# EAGLE design Display_Board_v2 (EAGLE 8.7.0)

## Sheet 1 of 3: Micro and CAN
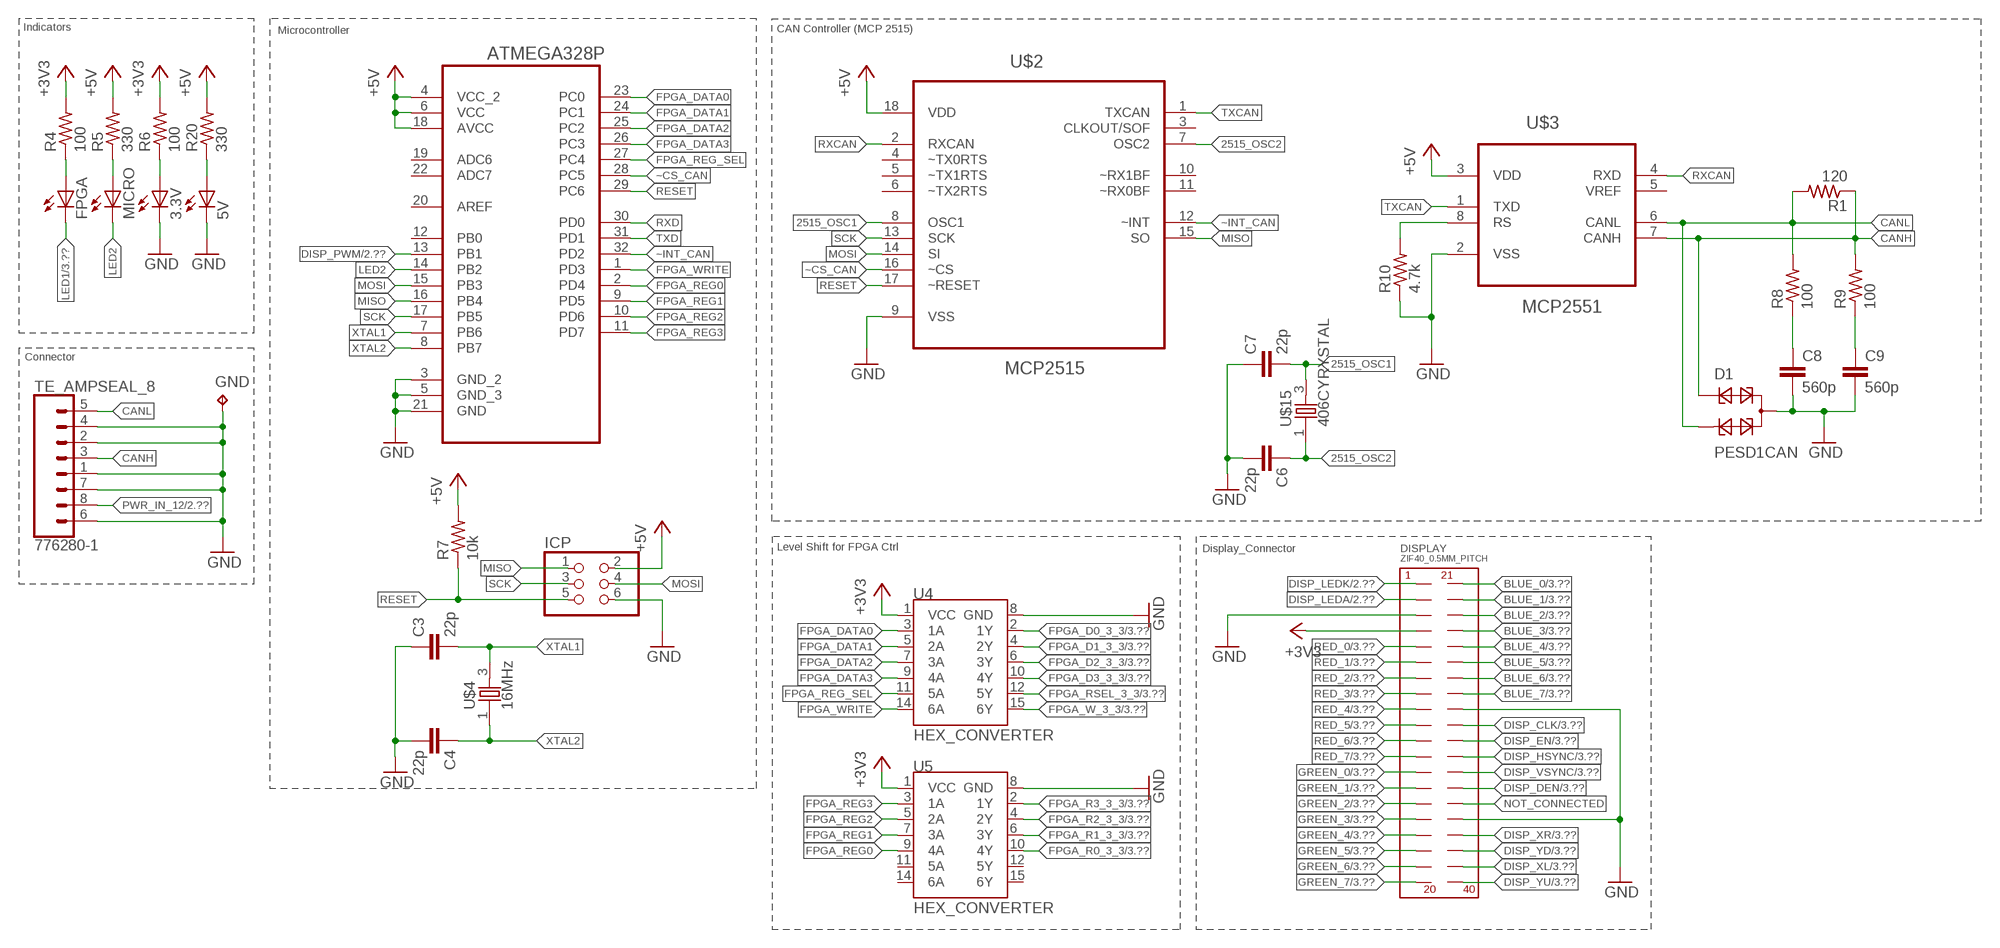
[diagram p0: schematic, sheet 1]

### Parts
3.3V  LEDCHIP-LED0805  [CHIP-LED0805]
5V  LEDCHIP-LED0805  [CHIP-LED0805]
ATMEGA328P  ATMEGA328P-AU  [QFP80P900X900X120-32N]
C3  22p  C-EUC0805K  [C0805K]
C4  22p  C-EUC0805K  [C0805K]
C6  22p  C-EUC0805K  [C0805K]
C7  22p  C-EUC0805K  [C0805K]
C8  560p  C-EUC0805K  [C0805K]
C9  560p  C-EUC0805K  [C0805K]
D1  PESD1CAN  [SOT23]
DISPLAY  ZIF40_0.5MM_PITCH  [ZIF40]
FPGA  LEDCHIP-LED0805  [CHIP-LED0805]
GND  TPTP12SQ  [TP12SQ]
ICP  PINHD-2X3  [2X03]
MICRO  LEDCHIP-LED0805  [CHIP-LED0805]
R1  120  R-US_R0805  [R0805]
R4  100  R-US_R0805  [R0805]
R5  330  R-US_R0805  [R0805]
R6  100  R-US_R0805  [R0805]
R7  10k  R-US_R0805  [R0805]
R8  100  R-US_R0805  [R0805]
R9  100  R-US_R0805  [R0805]
R10  4.7k  R-US_R0805  [R0805]
R20  330  R-US_R0805  [R0805]
TE_AMPSEAL_8  776280-1  [776280-1]
U4  HEX_CONVERTER  [SO016]
U5  HEX_CONVERTER  [SO016]
U$2  MCP2515  MCP2515-I/SO  [SOIC127P1034X264-18N]
U$3  MCP2551  MCP2551-I/SN  [SOIC127P600X175-8N]
U$4  16MHz  406CYRYSTAL  [CTS406]
U$15  406CYRYSTAL  [CTS406]

### Nets
2515_OSC1: C7.2 U$2.8(OSC1) U$15.3
2515_OSC2: C6.1 U$2.7(OSC2) U$15.1
+3V3: DISPLAY.P$4 R4.2 R6.2 U4.1(VCC) U5.1(VCC) ; also sheet 2,3
+5V: ATMEGA328P.4(VCC_2) ATMEGA328P.6(VCC) ATMEGA328P.18(AVCC) ICP.2 R5.2 R7.2 R20.2 U$2.18(VDD) U$3.3(VDD) ; also sheet 2
BLUE_0: DISPLAY.P$21 ; also sheet 3
BLUE_1: DISPLAY.P$22 ; also sheet 3
BLUE_2: DISPLAY.P$23 ; also sheet 3
BLUE_3: DISPLAY.P$24 ; also sheet 3
BLUE_4: DISPLAY.P$25 ; also sheet 3
BLUE_5: DISPLAY.P$26 ; also sheet 3
BLUE_6: DISPLAY.P$27 ; also sheet 3
BLUE_7: DISPLAY.P$28 ; also sheet 3
CANH: D1.1 R1.1 R9.2 TE_AMPSEAL_8.3 U$3.7(CANH)
CANL: D1.2 R1.2 R8.2 TE_AMPSEAL_8.5 U$3.6(CANL)
DISP_CLK: DISPLAY.P$30 ; also sheet 3
DISP_DEN: DISPLAY.P$34 ; also sheet 3
DISP_EN: DISPLAY.P$31 ; also sheet 3
DISP_HSYNC: DISPLAY.P$32 ; also sheet 3
DISP_LEDA: DISPLAY.P$2 ; also sheet 2
DISP_LEDK: DISPLAY.P$1 ; also sheet 2
DISP_PWM: ATMEGA328P.13(PB1) ; also sheet 2
DISP_VSYNC: DISPLAY.P$33 ; also sheet 3
DISP_XL: DISPLAY.P$39 ; also sheet 3
DISP_XR: DISPLAY.P$37 ; also sheet 3
DISP_YD: DISPLAY.P$38 ; also sheet 3
DISP_YU: DISPLAY.P$40 ; also sheet 3
FPGA_D0_3_3: U4.2(1Y) ; also sheet 3
FPGA_D1_3_3: U4.4(2Y) ; also sheet 3
FPGA_D2_3_3: U4.6(3Y) ; also sheet 3
FPGA_D3_3_3: U4.10(4Y) ; also sheet 3
FPGA_DATA0: ATMEGA328P.23(PC0) U4.3(1A)
FPGA_DATA1: ATMEGA328P.24(PC1) U4.5(2A)
FPGA_DATA2: ATMEGA328P.25(PC2) U4.7(3A)
FPGA_DATA3: ATMEGA328P.26(PC3) U4.9(4A)
FPGA_R0_3_3: U5.10(4Y) ; also sheet 3
FPGA_R1_3_3: U5.6(3Y) ; also sheet 3
FPGA_R2_3_3: U5.4(2Y) ; also sheet 3
FPGA_R3_3_3: U5.2(1Y) ; also sheet 3
FPGA_REG0: ATMEGA328P.2(PD4) U5.9(4A)
FPGA_REG1: ATMEGA328P.9(PD5) U5.7(3A)
FPGA_REG2: ATMEGA328P.10(PD6) U5.5(2A)
FPGA_REG3: ATMEGA328P.11(PD7) U5.3(1A)
FPGA_REG_SEL: ATMEGA328P.27(PC4) U4.11(5A)
FPGA_RSEL_3_3: U4.12(5Y) ; also sheet 3
FPGA_W_3_3: U4.15(6Y) ; also sheet 3
FPGA_WRITE: ATMEGA328P.1(PD3) U4.14(6A)
GND: 3.3V.C 5V.C ATMEGA328P.3(GND_2) ATMEGA328P.5(GND_3) ATMEGA328P.21(GND) C3.1 C4.2 C6.2 C7.1 C8.2 C9.2 D1.3 DISPLAY.P$3 DISPLAY.P$29 DISPLAY.P$36 GND.TP ICP.6 R10.1 TE_AMPSEAL_8.1 TE_AMPSEAL_8.2 TE_AMPSEAL_8.4 TE_AMPSEAL_8.6 TE_AMPSEAL_8.7 U4.8(GND) U5.8(GND) U$2.9(VSS) U$3.2(VSS) ; also sheet 2,3
GREEN_0: DISPLAY.P$13 ; also sheet 3
GREEN_1: DISPLAY.P$14 ; also sheet 3
GREEN_2: DISPLAY.P$15 ; also sheet 3
GREEN_3: DISPLAY.P$16 ; also sheet 3
GREEN_4: DISPLAY.P$17 ; also sheet 3
GREEN_5: DISPLAY.P$18 ; also sheet 3
GREEN_6: DISPLAY.P$19 ; also sheet 3
GREEN_7: DISPLAY.P$20 ; also sheet 3
LED1: FPGA.C ; also sheet 3
LED2: ATMEGA328P.14(PB2) MICRO.C
MISO: ATMEGA328P.16(PB4) ICP.1 U$2.15(SO)
MOSI: ATMEGA328P.15(PB3) ICP.4 U$2.14(SI)
N$2: FPGA.A R4.1
N$3: MICRO.A R5.1
N$4: 3.3V.A R6.1
N$5: R10.2 U$3.8(RS)
N$6: C8.1 R8.1
N$7: C9.1 R9.1
N$12: 5V.A R20.1
NOT_CONNECTED: DISPLAY.P$35
PWR_IN_12: TE_AMPSEAL_8.8 ; also sheet 2
RED_0: DISPLAY.P$5 ; also sheet 3
RED_1: DISPLAY.P$6 ; also sheet 3
RED_2: DISPLAY.P$7 ; also sheet 3
RED_3: DISPLAY.P$8 ; also sheet 3
RED_4: DISPLAY.P$9 ; also sheet 3
RED_5: DISPLAY.P$10 ; also sheet 3
RED_6: DISPLAY.P$11 ; also sheet 3
RED_7: DISPLAY.P$12 ; also sheet 3
RESET: ATMEGA328P.29(PC6) ICP.5 R7.1 U$2.17(~RESET)
RXCAN: U$2.2(RXCAN) U$3.4(RXD)
RXD: ATMEGA328P.30(PD0)
SCK: ATMEGA328P.17(PB5) ICP.3 U$2.13(SCK)
TXCAN: U$2.1(TXCAN) U$3.1(TXD)
TXD: ATMEGA328P.31(PD1)
XTAL1: ATMEGA328P.7(PB6) C3.2 U$4.3
XTAL2: ATMEGA328P.8(PB7) C4.1 U$4.1
~CS_CAN: ATMEGA328P.28(PC5) U$2.16(~CS)
~INT_CAN: ATMEGA328P.32(PD2) U$2.12(~INT)
Unconnected: ATMEGA328P.12(PB0) ATMEGA328P.19(ADC6) ATMEGA328P.20(AREF) ATMEGA328P.22(ADC7) U5.11(5A) U5.12(5Y) U5.14(6A) U5.15(6Y) U$2.3(CLKOUT/SOF) U$2.4(~TX0RTS) U$2.5(~TX1RTS) U$2.6(~TX2RTS) U$2.10(~RX1BF) U$2.11(~RX0BF) U$3.5(VREF)

### Notes on the sheet
- Indicators | Microcontroller | CAN Controller (MCP 2515)
- Connector
- Level Shift for FPGA Ctrl | Display_Connector

## Sheet 2 of 3: Power
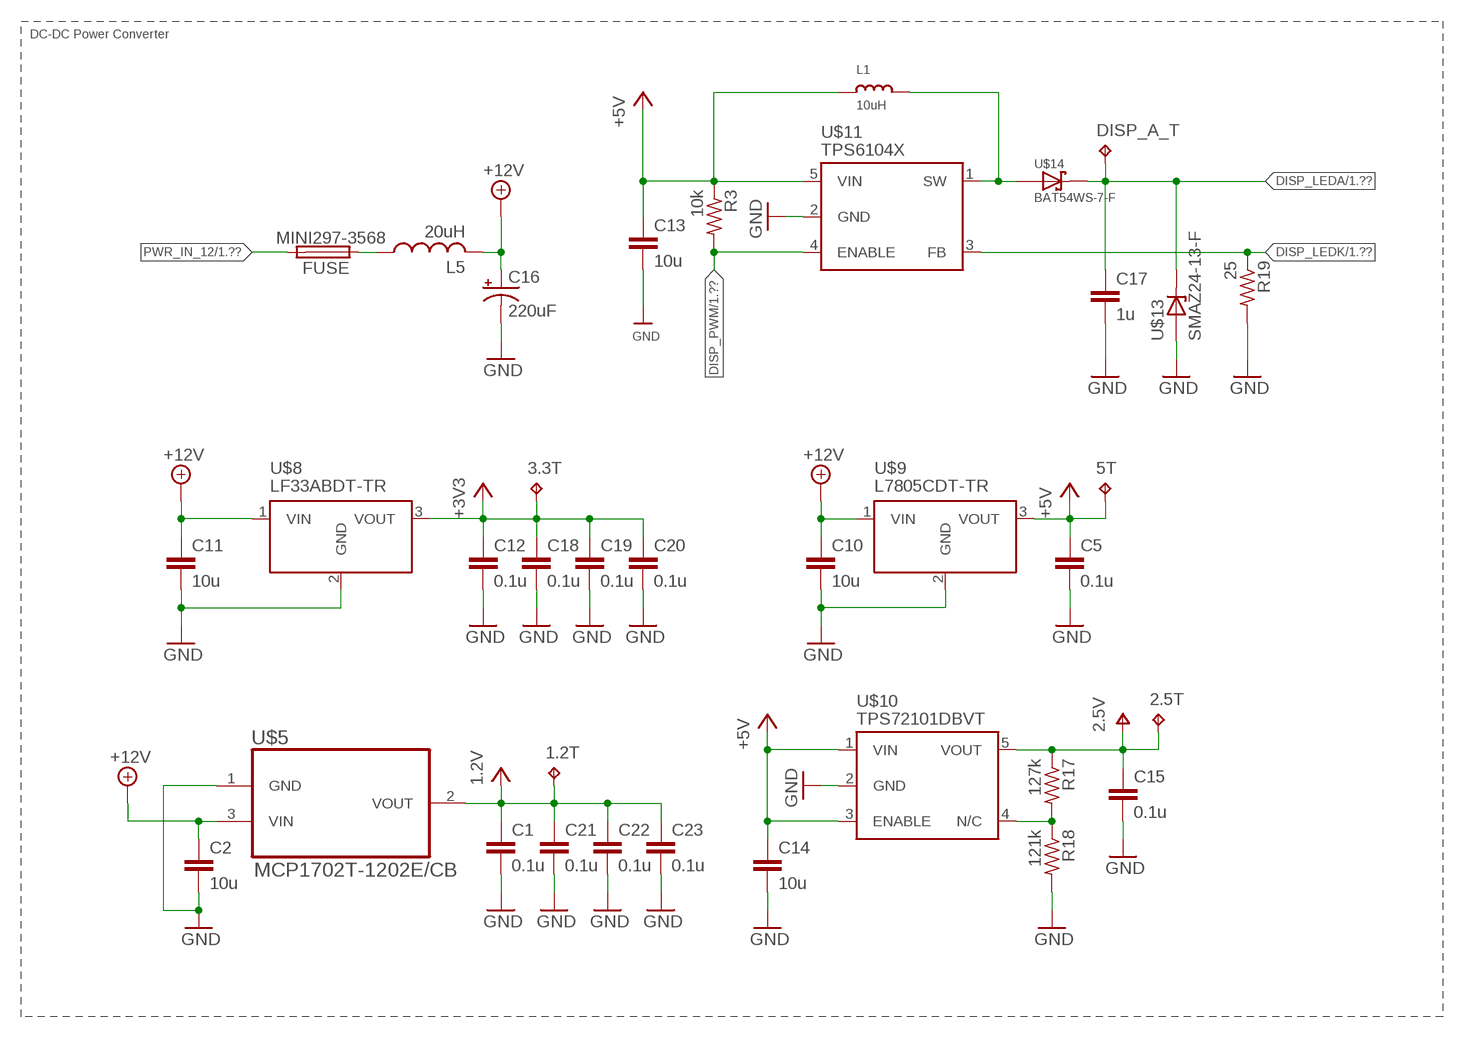
[diagram p1: schematic, sheet 2]

### Parts
1.2T  TPTP12SQ  [TP12SQ]
2.5T  TPTP12SQ  [TP12SQ]
3.3T  TPTP12SQ  [TP12SQ]
5T  TPTP12SQ  [TP12SQ]
C1  0.1u  C-EUC0805K  [C0805K]
C2  10u  C-EUC0805K  [C0805K]
C5  0.1u  C-EUC0805K  [C0805K]
C10  10u  C-EUC0805K  [C0805K]
C11  10u  C-EUC0805K  [C0805K]
C12  0.1u  C-EUC0805K  [C0805K]
C13  10u  C-EUC0805K  [C0805K]
C14  10u  C-EUC0805K  [C0805K]
C15  0.1u  C-EUC0805K  [C0805K]
C16  220uF  CPOL-USUD-6,3X7,7  [UD-6,3X7,7_NICHICON]
C17  1u  C-EUC0805K  [C0805K]
C18  0.1u  C-EUC0805K  [C0805K]
C19  0.1u  C-EUC0805K  [C0805K]
C20  0.1u  C-EUC0805K  [C0805K]
C21  0.1u  C-EUC0805K  [C0805K]
C22  0.1u  C-EUC0805K  [C0805K]
C23  0.1u  C-EUC0805K  [C0805K]
DISP_A_T  TPTP12SQ  [TP12SQ]
FUSE  MINI297-3568  [3568]
L1  10uH  INDUCTORNR5040  [INDUCTOR_5X5MM_NR5040_NOTHERMALS]
L5  20uH  MSS7348  [MSS7348]
R3  10k  R-US_R0805  [R0805]
R17  127k  R-US_R0805  [R0805]
R18  121k  R-US_R0805  [R0805]
R19  25  R-US_R0805  [R0805]
U$5  MCP1702T-1202E/CB  MCP1702T-1802E/CB  [SOT95P300X145-3N]
U$8  LF33ABDT-TR  [DPACK]
U$9  L7805CDT-TR  [DPACK]
U$10  TPS72101DBVT  [SOT23-5L]
U$11  TPS6104X  [SOT23-5L]
U$13  SMAZ24-13-F  [SMA_DIODE]
U$14  BAT54WS-7-F  [SOD323]

### Nets
+3V3: 3.3T.TP C12.1 C18.1 C19.1 C20.1 U$8.3(VOUT) ; also sheet 1,3
+5V: 5T.TP C5.1 C13.1 C14.1 L1.P$1 R3.1 U$9.3(VOUT) U$10.1(VIN) U$10.3(ENABLE) U$11.5(VIN) ; also sheet 1
+12V: C2.1 C10.1 C11.1 C16.+ L5.P$2 U$5.3(VIN) U$8.1(VIN) U$9.1(VIN)
DISP_LEDA: C17.1 DISP_A_T.TP U$13.C U$14.1(C) ; also sheet 1
DISP_LEDK: R19.1 U$11.3(FB) ; also sheet 1
DISP_PWM: R3.2 U$11.4(ENABLE) ; also sheet 1
GND: C1.2 C2.2 C5.2 C10.2 C11.2 C12.2 C13.2 C14.2 C15.2 C16.- C17.2 C18.2 C19.2 C20.2 C21.2 C22.2 C23.2 R18.2 R19.2 U$5.1(GND) U$8.2(GND) U$9.2(GND) U$10.2(GND) U$11.2(GND) U$13.A ; also sheet 1,3
N$1: FUSE.P$1 FUSE.P$4 L5.P$1
N$8: L1.P$2 U$11.1(SW) U$14.2(A)
N$19: R17.2 R18.1 U$10.4(N/C)
PWR_IN_12: FUSE.P$2 FUSE.P$3 ; also sheet 1
V+: 2.5T.TP C15.1 R17.1 U$10.5(VOUT) ; supply symbol labelled 2.5V ; also sheet 3
VCC: 1.2T.TP C1.1 C21.1 C22.1 C23.1 U$5.2(VOUT) ; supply symbol labelled 1.2V ; also sheet 3

### Notes on the sheet
- DC-DC Power Converter

## Sheet 3 of 3: Cyclone 10 FPGA
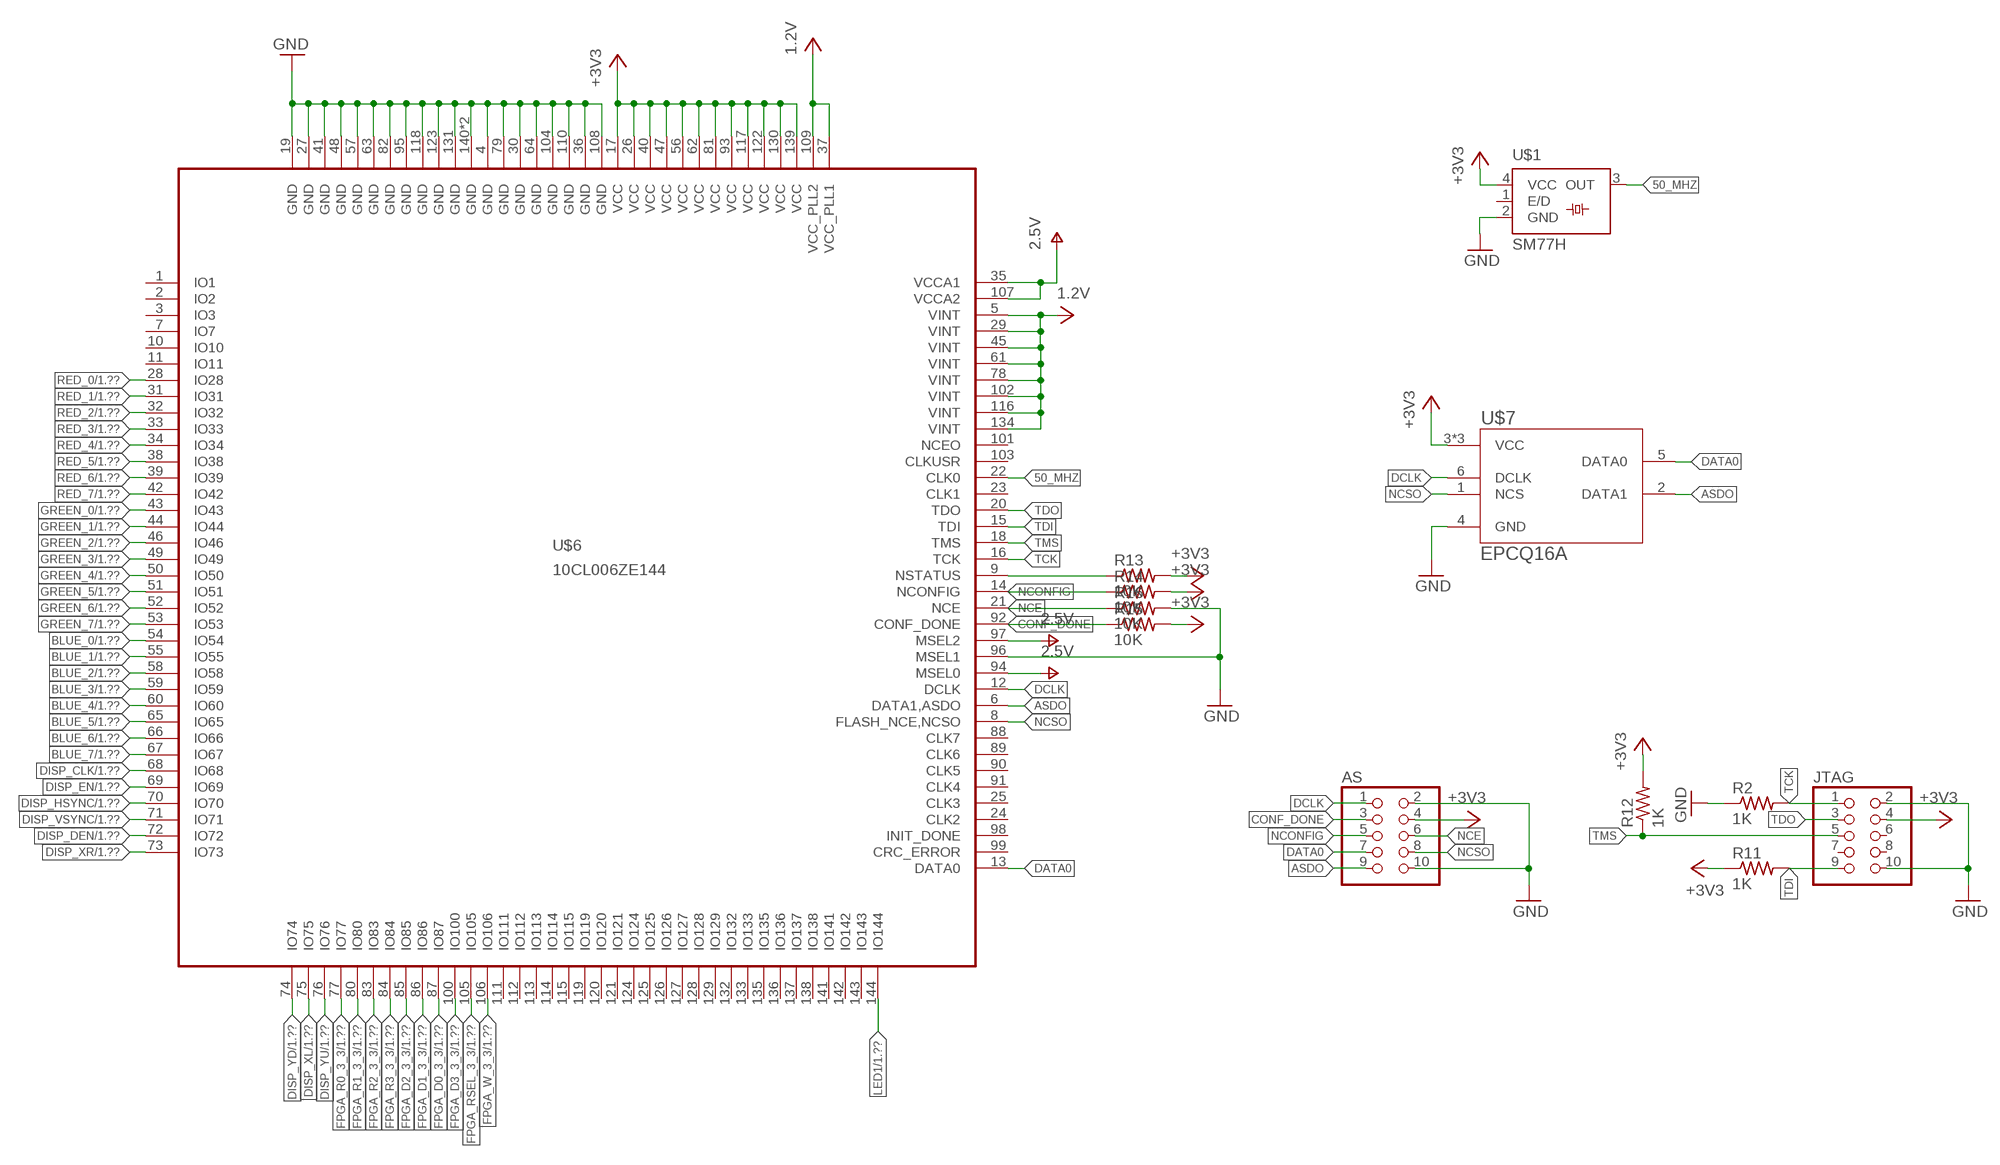
[diagram p2: schematic, sheet 3]

### Parts
AS  PINHD-2X5  [2X05]
JTAG  PINHD-2X5  [2X05]
R2  1K  R-US_R0805  [R0805]
R11  1K  R-US_R0805  [R0805]
R12  1K  R-US_R0805  [R0805]
R13  10K  R-US_R0805  [R0805]
R14  10K  R-US_R0805  [R0805]
R15  10K  R-US_R0805  [R0805]
R16  10K  R-US_R0805  [R0805]
U$1  SM77H  [SM77H]
U$6  10CL006ZE144  [EQFP144]
U$7  EPCQ16A  [SOIC127P600X175-8N]

### Nets
50_MHZ: U$1.3(OUT) U$6.22(CLK0)
+3V3: AS.4 JTAG.4 R11.1 R12.2 R13.2 R14.2 R15.2 U$1.4(VCC) U$6.17(VCC) U$6.26(VCC) U$6.40(VCC) U$6.47(VCC) U$6.56(VCC) U$6.62(VCC) U$6.81(VCC) U$6.93(VCC) U$6.117(VCC) U$6.122(VCC) U$6.130(VCC) U$6.139(VCC) U$7.3(VCC) U$7.7(VCC) U$7.8(VCC) ; also sheet 1,2
ASDO: AS.9 U$6.6(DATA1,ASDO) U$7.2(DATA1)
BLUE_0: U$6.54(IO54) ; also sheet 1
BLUE_1: U$6.55(IO55) ; also sheet 1
BLUE_2: U$6.58(IO58) ; also sheet 1
BLUE_3: U$6.59(IO59) ; also sheet 1
BLUE_4: U$6.60(IO60) ; also sheet 1
BLUE_5: U$6.65(IO65) ; also sheet 1
BLUE_6: U$6.66(IO66) ; also sheet 1
BLUE_7: U$6.67(IO67) ; also sheet 1
CONF_DONE: AS.3 R15.1 U$6.92(CONF_DONE)
DATA0: AS.7 U$6.13(DATA0) U$7.5(DATA0)
DCLK: AS.1 U$6.12(DCLK) U$7.6(DCLK)
DISP_CLK: U$6.68(IO68) ; also sheet 1
DISP_DEN: U$6.72(IO72) ; also sheet 1
DISP_EN: U$6.69(IO69) ; also sheet 1
DISP_HSYNC: U$6.70(IO70) ; also sheet 1
DISP_VSYNC: U$6.71(IO71) ; also sheet 1
DISP_XL: U$6.75(IO75) ; also sheet 1
DISP_XR: U$6.73(IO73) ; also sheet 1
DISP_YD: U$6.74(IO74) ; also sheet 1
DISP_YU: U$6.76(IO76) ; also sheet 1
FPGA_D0_3_3: U$6.87(IO87) ; also sheet 1
FPGA_D1_3_3: U$6.86(IO86) ; also sheet 1
FPGA_D2_3_3: U$6.85(IO85) ; also sheet 1
FPGA_D3_3_3: U$6.100(IO100) ; also sheet 1
FPGA_R0_3_3: U$6.77(IO77) ; also sheet 1
FPGA_R1_3_3: U$6.80(IO80) ; also sheet 1
FPGA_R2_3_3: U$6.83(IO83) ; also sheet 1
FPGA_R3_3_3: U$6.84(IO84) ; also sheet 1
FPGA_RSEL_3_3: U$6.105(IO105) ; also sheet 1
FPGA_W_3_3: U$6.106(IO106) ; also sheet 1
GND: AS.2 AS.10 JTAG.2 JTAG.10 R2.1 R16.2 U$1.2(GND) U$6.4(GND) U$6.19(GND) U$6.27(GND) U$6.30(GND) U$6.36(GND) U$6.41(GND) U$6.48(GND) U$6.57(GND) U$6.63(GND) U$6.64(GND) U$6.79(GND) U$6.82(GND) U$6.95(GND) U$6.96(MSEL1) U$6.104(GND) U$6.108(GND) U$6.110(GND) U$6.118(GND) U$6.123(GND) U$6.131(GND) U$6.140(GND) U$6.E(GND) U$7.4(GND) ; also sheet 1,2
GREEN_0: U$6.43(IO43) ; also sheet 1
GREEN_1: U$6.44(IO44) ; also sheet 1
GREEN_2: U$6.46(IO46) ; also sheet 1
GREEN_3: U$6.49(IO49) ; also sheet 1
GREEN_4: U$6.50(IO50) ; also sheet 1
GREEN_5: U$6.51(IO51) ; also sheet 1
GREEN_6: U$6.52(IO52) ; also sheet 1
GREEN_7: U$6.53(IO53) ; also sheet 1
LED1: U$6.144(IO144) ; also sheet 1
N$10: R13.1 U$6.9(NSTATUS)
NCE: AS.6 R16.1 U$6.21(NCE)
NCONFIG: AS.5 R14.1 U$6.14(NCONFIG)
NCSO: AS.8 U$6.8(FLASH_NCE,NCSO) U$7.1(NCS)
RED_0: U$6.28(IO28) ; also sheet 1
RED_1: U$6.31(IO31) ; also sheet 1
RED_2: U$6.32(IO32) ; also sheet 1
RED_3: U$6.33(IO33) ; also sheet 1
RED_4: U$6.34(IO34) ; also sheet 1
RED_5: U$6.38(IO38) ; also sheet 1
RED_6: U$6.39(IO39) ; also sheet 1
RED_7: U$6.42(IO42) ; also sheet 1
TCK: JTAG.1 R2.2 U$6.16(TCK)
TDI: JTAG.9 R11.2 U$6.15(TDI)
TDO: JTAG.3 U$6.20(TDO)
TMS: JTAG.5 R12.1 U$6.18(TMS)
V+: U$6.35(VCCA1) U$6.94(MSEL0) U$6.97(MSEL2) U$6.107(VCCA2) ; supply symbol labelled 2.5V ; also sheet 2
VCC: U$6.5(VINT) U$6.29(VINT) U$6.37(VCC_PLL1) U$6.45(VINT) U$6.61(VINT) U$6.78(VINT) U$6.102(VINT) U$6.109(VCC_PLL2) U$6.116(VINT) U$6.134(VINT) ; supply symbol labelled 1.2V ; also sheet 2
Unconnected: JTAG.6 JTAG.7 JTAG.8 U$1.1(E/D) U$6.1(IO1) U$6.2(IO2) U$6.3(IO3) U$6.7(IO7) U$6.10(IO10) U$6.11(IO11) U$6.24(CLK2) U$6.25(CLK3) U$6.88(CLK7) U$6.89(CLK6) U$6.90(CLK5) U$6.91(CLK4) U$6.98(INIT_DONE) U$6.99(CRC_ERROR) U$6.111(IO111) U$6.112(IO112) U$6.113(IO113) U$6.114(IO114) U$6.115(IO115) U$6.119(IO119) U$6.120(IO120) U$6.121(IO121) U$6.124(IO124) U$6.125(IO125) U$6.126(IO126) U$6.127(IO127) U$6.128(IO128) U$6.129(IO129) U$6.132(IO132) U$6.133(IO133) U$6.135(IO135) U$6.136(IO136) U$6.137(IO137) U$6.138(IO138) U$6.141(IO141) U$6.142(IO142) U$6.143(IO143)

## Power pins joined to a net without a drawn wire
CLK1: U$6.23(CLK1)
CLKUSR: U$6.103(CLKUSR)
NCEO: U$6.101(NCEO)

## Library data of the parts
1.2T 2.5T 3.3T 5T DISP_A_T GND = testpad:TP: Test pad
3.3V 5V FPGA MICRO = led:LED: LED OSRAM: - CHIPLED LG R971, LG N971, LY N971, LG Q971, LY Q971, LO R971, LY R971 LH N974, LH R974 LS Q976, LO Q976, LY Q976 LO Q996 - Hyper CHIPLED LW Q18S LB Q993, LB Q99A, LB R99A - SideLED LS A670, LO A670, LY A670, LG A670, LP A670 LB A673, LV A673, LT A673, LW A673 LH A674 LY A675 LS A676, LA A676, LO A676, LY A676, LW A676 LS A679, LY A679, LG A679 - Hyper Micro SIDELED® LS Y876, LA Y876, LO Y876, LY Y876 LT Y87S - SmartLED LW L88C, LW L88S LB L89C, LB L89S, LG L890 LS L89K, LO L89K, LY L89K LS L896, LA L896, LO L896, LY L896 - TOPLED LS T670, LO T670, LY T670, LG T670, LP T670 LSG T670, LSP T670, LSY T670, LOP T670, LYG T670 LG T671, LOG T671, LSG T671 LB T673, LV T673, LT T673, LW T673 LH T674 LS T676, LA T676, LO T676, LY T676, LB T676, LH T676, LSB T676, LW T676 LB T67C, LV T67C, LT T67C, LS T67K, LO T67K, LY T67K, LW E67C LS E67B, LA E67B, LO E67B, LY E67B, LB E67C, LV E67C, LT E67C LW T67C LS T679, LY T679, LG T679 LS T770, LO T770, LY T770, LG T770, LP T770 LB T773, LV T773, LT T773, LW T773 LH T774 LS E675, LA E675, LY E675, LS T675 LS T776, LA T776, LO T776, LY T776, LB T776 LHGB T686 LT T68C, LB T68C - Hyper Mini TOPLED® LB M676 - Mini TOPLED Santana® LG M470 LS M47K, LO M47K, LY M47K Source: http://www.osram.convergy.de LUXEON: - LUMILED® LXK2-PW12-R00, LXK2-PW12-S00, LXK2-PW14-U00, LXK2-PW14-V00 LXK2-PM12-R00, LXK2-PM12-S00, LXK2-PM14-U00 LXK2-PE12-Q00, LXK2-PE12-R00, LXK2-PE12-S00, LXK2-PE14-T00, LXK2-PE14-U00 LXK2-PB12-K00, LXK2-PB12-L00, LXK2-PB12-M00, LXK2-PB14-N00, LXK2-PB14-P00, LXK2-PB14-Q00 LXK2-PR12-L00, LXK2-PR12-M00, LXK2-PR14-Q00, LXK2-PR14-R00 LXK2-PD12-Q00, LXK2-PD12-R00, LXK2-PD12-S00 LXK2-PH12-R00, LXK2-PH12-S00 LXK2-PL12-P00, LXK2-PL12-Q00, LXK2-PL12-R00 Source: www.luxeon.com KINGBRIGHT: KA-3528ASYC Source: www.kingbright.com
AS JTAG = pinhead:PINHD-2X5: PIN HEADER
ATMEGA328P = Atmel_By_element14_Batch_1-00:ATMEGA328P-AU: 8-bit Microcontroller with In-System Programmable Flash; MPN: ATMEGA328P-AU; OC_FARNELL: 1715486; OC_NEWARK: 14R4631; PACKAGE: TQFP-32; SUPPLIER: Atmel
C1 C2 C5 C8-C15 C17-C23 = rcl:C-EU: CAPACITOR, European symbol
C3 C4 C6 C7 = resistor:C-EU: CAPACITOR, European symbol
C16 = rcl:CPOL-US: POLARIZED CAPACITOR, American symbol; SPICEPREFIX: C
D1 = diode:PESD1CAN: CAN bus ESD protection diode Source: http://www.nxp.com/documents/data_sheet/PESD1CAN.pdf
DISPLAY = Connectors:ZIF40_0.5MM_PITCH: 40 Pin 0.5mm ptch FPC Connector http://www.buydisplay.com/default/40-pin-0-5mm-pitch-top-contact-zif-connector-fpc-connector
FUSE = Fuse:MINI297-3568
ICP = pinhead:PINHD-2X3: PIN HEADER
L1 = microbuilder:INDUCTOR: Inductors 0603: 10nH Ceramic Inductor - microwire antenna/RF (Digikey: 712-1434-2-ND) 0805: 560nH Ceramic Inductor - RF (Digikey: 553-1047-1-ND) 270nH Ceramic Inductor - Q = 40@250MHz, +-5%, 1 Ohm DC Resistance (Digikey: 535-10506-2-ND) 1007 (2518 Metric) SMT: 10µH 10% 250mOhm 820mA 1007 Inductor (Digikey: 587-2189-1-ND) 22µH 10% 500mOhm 580mA 1007 Inductor (Digikey: 587-2190-1-ND) 47µH 10% 950mOhm 420mA 1007 Inductor (Digikey: 587-2191-1-ND) 47µH 5% 100mOhm 1A 1008 Inductor (Digikey: 732-1816-1-ND) 5.0x5.0mm (Taiyo Yuden NR5040 Series) 6.8µH 20% 2.3A 64mOhm Inductor (Digikey: 587-2374-2-ND) 5.0x5.0mm (TDK VLC5045 Series) 4.7µH 20% 3.3A 34mOhm Inductor (Digikey: 445-6526-1-ND) 6.8µH 20% 2.7A 46mOhm Inductor (Digikey: 445-6527-1-ND) 6.0x6.0mm (TDK VLC6045 Series) 4.7µH 20% 3.8A 27mOhm Inductor (Digikey: 445-6538-2-ND) 6.8µH 20% 3A 41mOhm Inductor (Digikey: 445-6540-1-ND) 6.2µH 30% 2.2A 45mOhm Inductor (Digikey: SRR5028-6R2YCT-ND) - Not TDK VLC6045 but footprint should match 6.0x6.0mm (TDK SLF6045 Series) 6.8uH 30% 2A 33mOhm Inductor (Digikey: 445-4572-1-ND, Mouser: 810-SLF645T6R8N2R0PF) 6.0x6.0mm (Sumida CDRH5D28 Series) 6.2uH 30% 1.8A 45mOhm Inductor (Digikey: 308-1542-1-ND) Taiyo Yuden NR3015T2R2M - 2.2uH 20% 1.5A (Digikey: 587-1648-2-ND, Mouser: 963-NR3015T2R2M) - Used with TI TPS62172 CoilCraft RFID Transponder Coil - MA5532-AE (For use with AS3935 Lightning Sensor)
L5 = Inductors:MSS7348
R1 R7-R10 = rcl:R-US_: RESISTOR, American symbol
R2 R4-R6 R11-R16 R20 = resistor:R-US_: RESISTOR, American symbol
R3 R17-R19 = rcl:R-US_: RESISTOR, American symbol; SPICEPREFIX: R
TE_AMPSEAL_8 = IFE_AMPSEAL_Conn:776280-1: AMPSEAL 8pin Connector Ampseal 8-pin connector Model: 776280-1
U4 U5 = SparkFun-DigitalIC:HEX_CONVERTER: 74HC4050 Hex Buffer Level Shifter SMD SO016; PROD_ID: IC-09604
U$1 = Display_Custom:SM77H: SM77H Crystal Oscillator http://www.abracon.com/Oscillators/ASV.pdf
U$2 = Microchip_By_element14_Batch_1:MCP2515-I/SO: CAN Controller; MPN: MCP2515-I/SO; OC_FARNELL: 1292239; OC_NEWARK: 29H7136; PACKAGE: SOIC-18; SUPPLIER: Microchip
U$3 = Microchip_By_element14_Batch_1:MCP2551-I/SN: High-Speed CAN Transceiver; MPN: MCP2551-I/SN; OC_FARNELL: 9758569; OC_NEWARK: 69K7604; PACKAGE: SOIC-8; SUPPLIER: Microchip
U$4 U$15 = Display_Custom:406CYRYSTAL: Crystal Oscillator in 406 SMT Package https://www.ctscorp.com/wp-content/uploads/406.pdf
U$5 = Microchip_By_element14_Batch_1:MCP1702T-1802E/CB: Low Quiescent Current LDO Regulator; DESCRIPTION: LDO VOLT REG; MPN: MCP1702T-1802E/CB; OC_FARNELL: 1331488; OC_NEWARK: 84R5177; PACKAGE: SOT-3; SUPPLIER: Microchip
U$6 = Display_Custom:10CL006ZE144: Altera Cyclone 10 10CL006ZE144I8G
U$7 = Display_Custom:EPCQ16A: Altera Serial Config Flash EPCQ16A - SOIC8
U$8 = Display_Custom:LF33ABDT-TR: ST - LFxx LF33ABDT-TR 3.3V 500mA linear regulator
U$9 = Display_Custom:L7805CDT-TR: ST - L78 L7805CDT-TR 5V 1.5A Linear Regulator
U$10 = Display_Custom:TPS72101DBVT: TPS72101DBVT 2.5V 150mA SOT23-5 Linear Regulator from TI http://www.ti.com/lit/ds/symlink/tps721.pdf
U$11 = Display_Custom:TPS6104X: Texas Insturments TPS6104x Low-Power DC-DC Boost Converter in SOT-23 http://www.ti.com/lit/ds/symlink/tps61041.pdf
U$13 = Display_Custom:SMAZ24-13-F: Diodes Inc 24V Zener Diode 24V 1W zener diode is SMA package http://www.ti.com/lit/ds/symlink/tps61041.pdf
U$14 = Display_Custom:BAT54WS-7-F: Diodes Incorporated BAT54WS-7-F Small Form Factor 30V 100mA Schottkey Diode https://www.diodes.com/assets/Datasheets/ds30098.pdf

## Board
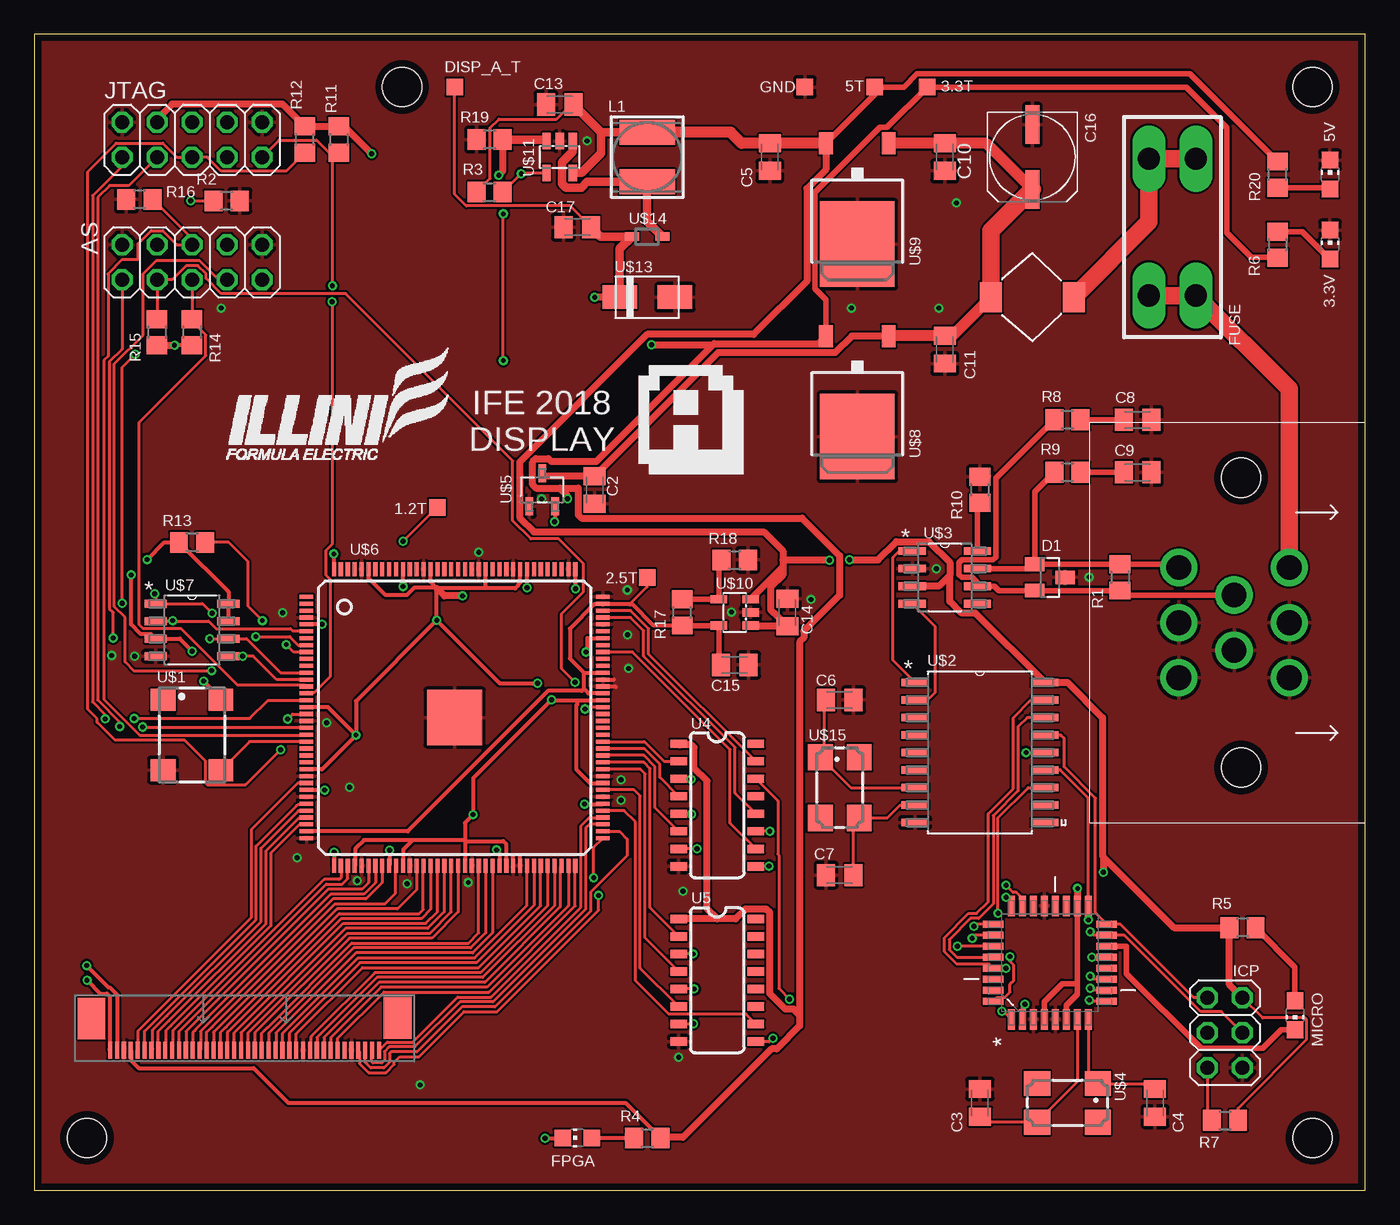
[diagram p3: board, top side]
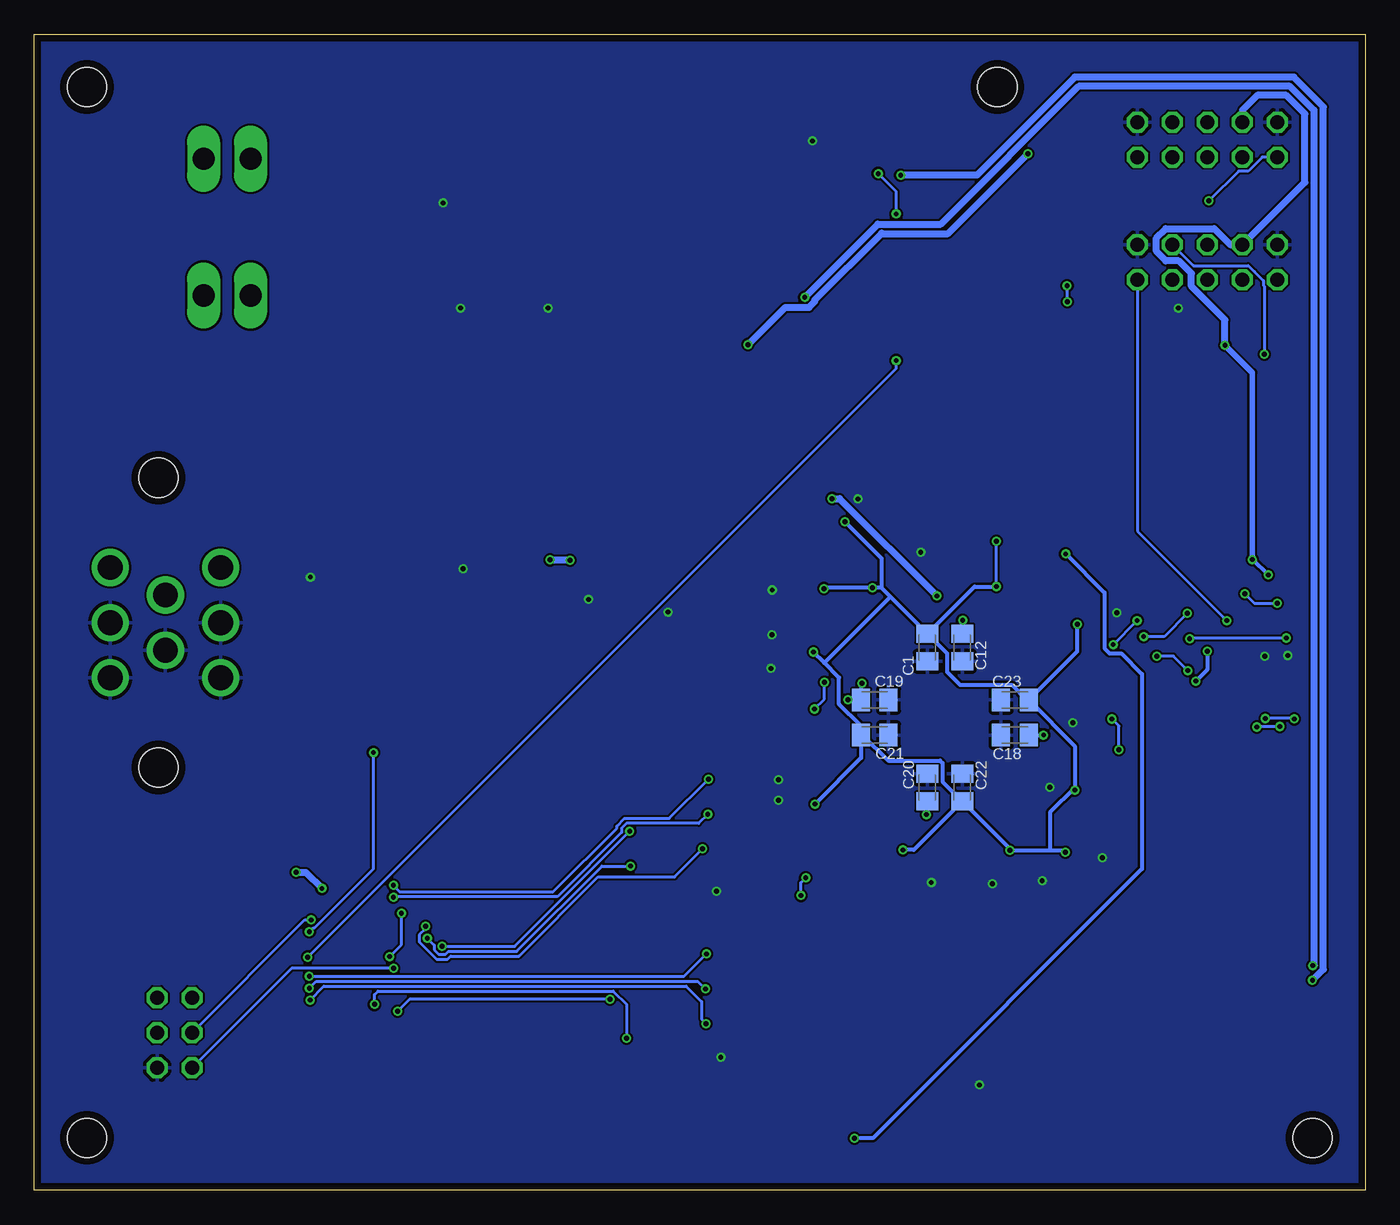
[diagram p4: board, bottom side, seen from below]

Size 96.52 x 83.82 mm. Coordinates in mm from the lower left corner, seen from the top.
Outline: 0,0 96.52,0 96.52,83.82 0,83.82 0,0
Copper layers (1*16): Top 0.035mm / dielectric 1.6mm / Bottom 0.035mm
Design rules "Elecrow_2-layer_PCB_eagle_rule": minimum track width 6mil, minimum drill 12mil, track to track 6mil, track to pad 6mil, pad to pad 6mil, via to via 8mil, smd to smd 0mil, copper to edge 20mil, drill to drill 10mil, minimum pad ring 6mil, minimum via ring 6mil, stop-mask expansion 0mil, vias tented up to drill 100mil, thermal gap 10mil
Holes 2.84 mm at 3.81,3.81 92.71,3.81 92.71,80.01 26.67,80.01

### Footprints (pad centres in the part's own frame; a part is rotated, then mirrored left to right if it is on the bottom)
TP12SQ = smd 1.2 x 1.2: TP 0,0
CHIP-LED0805 = smd 1.2 x 1.2: A 0,-1.05; C 0,1.05
2X05 = drill 1.016 octagon: 1 -5.08,-1.27; 2 -5.08,1.27; 3 -2.54,-1.27; 4 -2.54,1.27; 5 0,-1.27; 6 0,1.27; 7 2.54,-1.27; 8 2.54,1.27; 9 5.08,-1.27; 10 5.08,1.27
QFP80P900X900X120-32N = smd 1.473 x 0.508: 1 -4.115,2.794; 2 -4.115,2.007; 3 -4.115,1.194; 4 -4.115,0.406; 5 -4.115,-0.406; 6 -4.115,-1.194; 7 -4.115,-2.007; 8 -4.115,-2.794; 17 4.115,-2.794; 18 4.115,-2.007; 19 4.115,-1.194; 20 4.115,-0.406; 21 4.115,0.406; 22 4.115,1.194; 23 4.115,2.007; 24 4.115,2.794 | smd 0.508 x 1.473: 9 -2.794,-4.115; 10 -2.007,-4.115; 11 -1.194,-4.115; 12 -0.406,-4.115; 13 0.406,-4.115; 14 1.194,-4.115; 15 2.007,-4.115; 16 2.794,-4.115; 25 2.794,4.115; 26 2.007,4.115; 27 1.194,4.115; 28 0.406,4.115; 29 -0.406,4.115; 30 -1.194,4.115; 31 -2.007,4.115; 32 -2.794,4.115
C0805K = smd 1.3 x 1.6: 1 -1,0; 2 1,0
UD-6,3X7,7_NICHICON = smd 2.8 x 1: + 2.35,0; - -2.35,0
SOT23 = smd 1 x 1.4: 1 -0.95,-1.1; 2 0.95,-1.1; 3 0,1.1
ZIF40 = smd 0.3 x 1.25: P$1 -9.75,0; P$2 -9.25,0; P$3 -8.75,0; P$4 -8.25,0; P$5 -7.75,0; P$6 -7.25,0; P$7 -6.75,0; P$8 -6.25,0; P$9 -5.75,0; P$10 -5.25,0; P$11 -4.75,0; P$12 -4.25,0; P$13 -3.75,0; P$14 -3.25,0; P$15 -2.75,0; P$16 -2.25,0; P$17 -1.75,0; P$18 -1.25,0; P$19 -0.75,0; P$20 -0.25,0; P$21 0.25,0; P$22 0.75,0; P$23 1.25,0; P$24 1.75,0; P$25 2.25,0; P$26 2.75,0; P$27 3.25,0; P$28 3.75,0; P$29 4.25,0; P$30 4.75,0; P$31 5.25,0; P$32 5.75,0; P$33 6.25,0; P$34 6.75,0; P$35 7.25,0; P$36 7.75,0; P$37 8.25,0; P$38 8.75,0; P$39 9.25,0; P$40 9.75,0 | smd 2 x 3: P$41 -11.1,2.3; P$42 11.1,2.35
3568 = drill 1.6 long: P$1 -4.96,1.7; P$2 4.96,1.7; P$3 4.96,-1.7; P$4 -4.96,-1.7
2X03 = drill 1.016 octagon: 1 -2.54,-1.27; 2 -2.54,1.27; 3 0,-1.27; 4 0,1.27; 5 2.54,-1.27; 6 2.54,1.27
INDUCTOR_5X5MM_NR5040_NOTHERMALS = smd 1.8 x 4: P$1 -1.8,0; P$2 1.8,0
MSS7348 = smd 1.6 x 2.2: P$1 -3,0; P$2 3,0
R0805 = smd 1.3 x 1.5: 1 -0.95,0; 2 0.95,0
776280-1 = drill 1.8: 1 10.5,13.5; 2 14.5,13.5; 3 18.5,13.5; 4 12.5,9.5; 5 16.5,9.5; 6 10.5,5.5; 7 14.5,5.5; 8 18.5,5.5 | hole 2.85: 4,9; 25,9
SO016 = smd 0.6 x 1.2: 1 -4.445,-2.8; 2 -3.175,-2.8; 3 -1.905,-2.8; 4 -0.635,-2.8; 5 0.635,-2.8; 6 1.905,-2.8; 7 3.175,-2.8; 8 4.445,-2.8; 9 4.445,2.8; 10 3.175,2.8; 11 1.905,2.8; 12 0.635,2.8; 13 -0.635,2.8; 14 -1.905,2.8; 15 -3.175,2.8; 16 -4.445,2.8
SM77H = smd 1.6 x 1.8: 1 -2.55,-2.1; 2 2.55,-2.1; 3 2.55,2.1; 4 -2.55,2.1
SOIC127P1034X264-18N = smd 1.981 x 0.559: 1 -4.699,5.08; 2 -4.699,3.81; 3 -4.699,2.54; 4 -4.699,1.27; 5 -4.699,0; 6 -4.699,-1.27; 7 -4.699,-2.54; 8 -4.699,-3.81; 9 -4.699,-5.08; 10 4.699,-5.08; 11 4.699,-3.81; 12 4.699,-2.54; 13 4.699,-1.27; 14 4.699,0; 15 4.699,1.27; 16 4.699,2.54; 17 4.699,3.81; 18 4.699,5.08
SOIC127P600X175-8N = smd 1.981 x 0.559: 1 -2.362,1.905; 2 -2.362,0.635; 3 -2.362,-0.635; 4 -2.362,-1.905; 5 2.362,-1.905; 6 2.362,-0.635; 7 2.362,0.635; 8 2.362,1.905
CTS406 = smd 1.9 x 1.8: 1 -2.2,-1.4; 2 2.2,-1.4; 3 2.2,1.4; 4 -2.2,1.4
SOT95P300X145-3N = smd 0.559 x 1.321: 1 -0.94,-1.194; 2 0.94,-1.194; 3 0,1.194
EQFP144 = smd 1 x 0.3: 1 -10.75,8.75; 2 -10.75,8.25; 3 -10.75,7.75; 4 -10.75,7.25; 5 -10.75,6.75; 6 -10.75,6.25; 7 -10.75,5.75; 8 -10.75,5.25; 9 -10.75,4.75; 10 -10.75,4.25; 11 -10.75,3.75; 12 -10.75,3.25; 13 -10.75,2.75; 14 -10.75,2.25; 15 -10.75,1.75; 16 -10.75,1.25; 17 -10.75,0.75; 18 -10.75,0.25; 19 -10.75,-0.25; 20 -10.75,-0.75; 21 -10.75,-1.25; 22 -10.75,-1.75; 23 -10.75,-2.25; 24 -10.75,-2.75; 25 -10.75,-3.25; 26 -10.75,-3.75; 27 -10.75,-4.25; 28 -10.75,-4.75; 29 -10.75,-5.25; 30 -10.75,-5.75; 31 -10.75,-6.25; 32 -10.75,-6.75; 33 -10.75,-7.25; 34 -10.75,-7.75; 35 -10.75,-8.25; 36 -10.75,-8.75; 73 10.75,-8.75; 74 10.75,-8.25; 75 10.75,-7.75; 76 10.75,-7.25; 77 10.75,-6.75; 78 10.75,-6.25; 79 10.75,-5.75; 80 10.75,-5.25; 81 10.75,-4.75; 82 10.75,-4.25; 83 10.75,-3.75; 84 10.75,-3.25; 85 10.75,-2.75; 86 10.75,-2.25; 87 10.75,-1.75; 88 10.75,-1.25; 89 10.75,-0.75; 90 10.75,-0.25; 91 10.75,0.25; 92 10.75,0.75; 93 10.75,1.25; 94 10.75,1.75; 95 10.75,2.25; 96 10.75,2.75; 97 10.75,3.25; 98 10.75,3.75; 99 10.75,4.25; 100 10.75,4.75; 101 10.75,5.25; 102 10.75,5.75; 103 10.75,6.25; 104 10.75,6.75; 105 10.75,7.25; 106 10.75,7.75; 107 10.75,8.25; 108 10.75,8.75 | smd 0.3 x 1: 37 -8.75,-10.75; 38 -8.25,-10.75; 39 -7.75,-10.75; 40 -7.25,-10.75; 41 -6.75,-10.75; 42 -6.25,-10.75; 43 -5.75,-10.75; 44 -5.25,-10.75; 45 -4.75,-10.75; 46 -4.25,-10.75; 47 -3.75,-10.75; 48 -3.25,-10.75; 49 -2.75,-10.75; 50 -2.25,-10.75; 51 -1.75,-10.75; 52 -1.25,-10.75; 53 -0.75,-10.75; 54 -0.25,-10.75; 55 0.25,-10.75; 56 0.75,-10.75; 57 1.25,-10.75; 58 1.75,-10.75; 59 2.25,-10.75; 60 2.75,-10.75; 61 3.25,-10.75; 62 3.75,-10.75; 63 4.25,-10.75; 64 4.75,-10.75; 65 5.25,-10.75; 66 5.75,-10.75; 67 6.25,-10.75; 68 6.75,-10.75; 69 7.25,-10.75; 70 7.75,-10.75; 71 8.25,-10.75; 72 8.75,-10.75; 109 8.75,10.75; 110 8.25,10.75; 111 7.75,10.75; 112 7.25,10.75; 113 6.75,10.75; 114 6.25,10.75; 115 5.75,10.75; 116 5.25,10.75; 117 4.75,10.75; 118 4.25,10.75; 119 3.75,10.75; 120 3.25,10.75; 121 2.75,10.75; 122 2.25,10.75; 123 1.75,10.75; 124 1.25,10.75; 125 0.75,10.75; 126 0.25,10.75; 127 -0.25,10.75; 128 -0.75,10.75; 129 -1.25,10.75; 130 -1.75,10.75; 131 -2.25,10.75; 132 -2.75,10.75; 133 -3.25,10.75; 134 -3.75,10.75; 135 -4.25,10.75; 136 -4.75,10.75; 137 -5.25,10.75; 138 -5.75,10.75; 139 -6.25,10.75; 140 -6.75,10.75; 141 -7.25,10.75; 142 -7.75,10.75; 143 -8.25,10.75; 144 -8.75,10.75 | smd 4 x 4: E 0,0
SOIC127P600X175-8N' = smd 1.6 x 0.559: 1 -2.642,1.905; 2 -2.642,0.635; 3 -2.642,-0.635; 4 -2.642,-1.905; 5 2.642,-1.905; 6 2.642,-0.635; 7 2.642,0.635; 8 2.642,1.905
DPACK = smd 1 x 1.6: 1 -2.28,-4.8; 3 2.28,-4.8 | smd 5.4 x 6.2: 2 0,2.5
SOT23-5L = smd 0.6 x 1.2: 1 -0.95,-1.15; 2 0,-1.15; 3 0.95,-1.15; 4 0.95,1.15; 5 -0.95,1.15
SMA_DIODE = smd 2.5 x 1.7: A 2,0; C -2,0
SOD323 = smd 1 x 0.6: 1 -1.1,0; 2 1.1,0

### Placement (x,y rotation side)
1.2T  29.21,49.53 0 top
2.5T  44.45,44.45 0 top
3.3T  64.77,80.01 0 top
3.3V  93.98,68.58 0 top
5T  60.96,80.01 0 top
5V  93.98,73.66 0 top
AS  11.43,67.31 0 top
ATMEGA328P  73.66,16.51 90 top
C1  31.75,39.37 270 bottom
C2  40.64,50.8 270 top
C3  68.58,6.35 270 top
C4  81.28,6.35 270 top
C5  53.34,74.93 270 top
C6  58.42,35.56 0 top
C7  58.42,22.86 0 top
C8  80.01,55.88 0 top
C9  80.01,52.07 0 top
C10  66.04,74.93 270 top
C11  66.04,60.96 270 top
C12  29.21,39.37 270 bottom
C13  38.1,78.74 180 top
C14  54.61,41.91 90 top
C15  50.8,38.1 0 top
C16  72.39,74.93 270 top
C17  39.37,69.85 180 top
C18  25.4,33.02 180 bottom
C19  35.56,35.56 0 bottom
C20  31.75,29.21 90 bottom
C21  35.56,33.02 0 bottom
C22  29.21,29.21 90 bottom
C23  25.4,35.56 180 bottom
D1  73.66,44.45 270 top
DISP_A_T  30.48,80.01 0 top
DISPLAY  15.24,10.16 0 top
FPGA  39.37,3.81 90 top
FUSE  82.55,69.85 270 top
GND  55.88,80.01 0 top
ICP  86.36,11.43 270 top
JTAG  11.43,76.2 0 top
L1  44.45,74.93 270 top
L5  72.39,64.77 180 top
MICRO  91.44,12.7 180 top
R1  78.74,44.45 270 top
R2  13.94,71.75 180 top
R3  33.02,72.39 0 top
R4  44.45,3.81 0 top
R5  87.63,19.05 180 top
R6  90.17,68.58 270 top
R7  86.36,5.08 0 top
R8  74.93,55.88 180 top
R9  74.93,52.07 180 top
R10  68.58,50.8 270 top
R11  22.07,76.2 270 top
R12  19.61,76.2 90 top
R13  11.43,46.99 180 top
R14  11.43,62.23 270 top
R15  8.89,62.23 270 top
R16  7.62,71.86 180 top
R17  46.99,41.91 90 top
R18  50.8,45.72 0 top
R19  33.02,76.2 180 top
R20  90.17,73.66 90 top
TE_AMPSEAL_8  96.52,26.67 90 top
U4  49.53,27.94 270 top
U5  49.53,15.24 270 top
U$1  11.43,33.02 270 top
U$2  68.58,31.75 0 top
U$3  66.04,44.45 0 top
U$4  74.93,6.35 180 top
U$5  36.83,50.8 0 top
U$6  30.48,34.29 0 top
U$7  EPCQ16A  [SOIC127P600X175-8N']  11.43,40.64 0 top
U$8  59.69,57.15 180 top
U$9  59.69,71.12 180 top
U$10  50.8,41.91 90 top
U$11  38.1,74.93 180 top
U$13  44.45,64.77 0 top
U$14  44.45,69.16 0 top
U$15  58.42,29.21 270 top

### Tracks (layer width: path | path; a pad name or v marks a point on that pad's centre or on a via)
50_MHZ
  Top 0.203: U$6.22 15.6,32.54 U$1.3
2515_OSC1
  Top 0.203: U$2.8 62.79,27.94 61.86,27.01 U$15.3 59.42,26.61 C7.2
2515_OSC2
  Top 0.203: U$15.1 57.26,31.17 | 57.26,31.17 59.22,29.21 U$2.7 | C6.1 57.26,35.4 57.26,31.17
+3V3  (via drill 0.35)
  Top 0.305: 39.37,35.54 37.56,35.54 v37.52,35.59 31.83,29.9 v31.83,27.25 31.23,26.66 31.23,25.4 | 39.37,35.54 U$6.93 | 29.18,43.66 28.73,44.12 U$6.130 | v29.18,41.35 29.18,43.66 | 29.18,43.66 29.21,43.69 | 29.21,43.69 32.61,43.69 | 32.61,43.69 32.73,43.8 U$6.122 | 32.61,43.69 34.85,43.69 34.87,43.66 35.11,43.89 35.11,43.95 35.23,44.07 U$6.117 | v23.32,33.02 21.3,35.04 U$6.17 | U$6.26 20.85,30.53 23.32,32.99 v23.32,33.02 | 29.21,43.69 27.54,43.69 27.01,43.16 25.47,43.16 24.23,44.4 U$6.139 | 31.23,25.4 U$6.56 | 31.23,25.4 27.43,25.4 | 27.43,25.4 26.75,24.71 26.75,23.56 U$6.47 | 27.43,25.4 23.9,25.4 23.27,24.77 23.27,23.58 U$6.40 | 31.23,25.4 31.31,25.32 33.99,25.32 34.23,25.08 U$6.62 | v29.18,41.35 23.32,35.48 v23.32,33.02 | v29.18,41.35 33.76,36.78 v36.5,36.78 | 39.37,35.54 39.37,35.24 39.3,35.17 39.3,30.55 40.31,29.54 U$6.81 | DISPLAY.P$4 7.04,10.12 7.04,9.41 7.58,8.87 15.9,8.87 18.41,6.35 42.86,6.35 R4.2 | U$7.7 U$7.8 14.07,43.4 R13.2 9.42,46.99 v8.18,45.74 | v7.01,44.63 7.01,41.04 7.71,40.34 8.46,40.34 U$7.3 10.54,40.01 v11.44,39.1 | R14.2 v10.16,61.28 | v12.27,36.93 13.53,35.67 U$1.4
  Top 0.406: U$8.3 57.41,64.6 56.63,65.37 56.63,72.39 61.32,77.08 61.84,77.08 3.3T.TP 83.54,80.01 86.49,77.06 86.49,69.44 88.27,67.67 90.13,67.67 R6.2
  Top 0.508: U$8.3 56.86,61.4 49.31,61.4 49.2,61.29 | 38.1,50.93 36.38,50.93 36.14,51.16 36.14,52.82 36.38,53.06 37.28,53.06 37.48,52.86 40.76,52.86 49.2,61.29 | 38.1,50.93 39.43,50.93 39.43,48.98 39.67,48.74 55.68,48.74 58.4,46.02 58.4,43.16 55.82,40.58 55.82,40.09 55.51,39.78 55.51,12.7 | 55.51,12.7 55.51,11.93 53.84,10.26 53.47,10.26 47.04,3.83 45.42,3.83 R4.2 | 55.51,12.7 55.07,13.14 54.47,13.14 53.34,14.27 53.34,20.15 53.1,20.39 51.56,20.39 50.85,19.68 49.53,19.68 | 49.53,19.68 U5.1 | 49.53,19.68 48.79,20.42 48.79,29.69 47.85,30.63 47.85,32.11 47.65,32.31 46.81,32.31 U4.1 | 38.1,50.93 38.66,50.37 v38.66,50.16 | v31.06,43.1 29.74,43.1 29.18,43.66 | R15.2 v10.16,61.28 | JTAG.4 8.89,77.67 9.98,78.77 17.99,78.77 R12.2 R11.1 22.48,77.15 v24.45,75.18 | 49.2,61.29 44.8,61.29 v44.76,61.33
  Bottom 0.305: v37.52,35.59 37.49,35.56 C19.1 36.56,36.72 v36.5,36.78 | C12.1 29.21,41.33 v29.18,41.35 | C18.1 v23.32,33.02 | C20.1 31.83,28.13 v31.83,27.25 | v7.01,44.63 8.13,45.74 v8.18,45.74 | v11.44,39.1 11.44,37.76 v12.27,36.93
  Bottom 0.406: v8.18,45.74 8.18,59.3 v10.16,61.28
  Bottom 0.508: v38.66,50.16 38.12,50.16 v31.06,43.1 | JTAG.4 8.89,78.33 7.82,79.4 5.71,79.4 4.37,78.05 4.37,73.1 AS.4 9.78,68.58 10.95,69.75 14.45,69.75 15.14,69.06 15.14,68.1 14.45,67.41 13.52,67.41 12.6,66.49 12.6,65.56 10.16,63.12 v10.16,61.28 | 35.09,69.38 39.91,64.57 39.91,64.47 40.34,64.04 42.05,64.04 v44.76,61.33 | 35.09,69.38 35.07,69.41 | 24.45,75.28 v24.45,75.18 30.25,69.38 35.09,69.38
+5V  (via drill 0.35)
  Top 0.203: R7.2 87.31,5.96 92.29,10.95 92.29,12.36 92.14,12.5 89.1,12.5 ICP.2 | R3.1 33.07,73.39 33.07,77.06 33.7,77.69 37.85,77.69 38.91,78.74 C13.1
  Top 0.406: U$9.3 60.96,79.47 5T.TP 63.07,80.01 64.02,80.97 83.81,80.97 R20.2 | ATMEGA328P.18 75.67,15.06 | 75.67,15.06 75.67,14.22 74.85,13.41 ATMEGA328P.6 | ATMEGA328P.4 73.25,13.69 74.55,14.99 75.59,14.99 75.67,15.06
  Top 0.508: U$9.3 57.41,74.03 56.02,72.64 56.02,65.92 52.17,62.06 44.45,62.06 35.2,52.82 35.2,48.78 36.23,47.76 52.91,47.76 54.3,46.37 54.3,45.72 | 54.3,45.72 54.3,45.2 | 54.3,45.2 U$10.3 | 54.3,45.2 54.3,44.62 53.4,43.73 53.4,42.09 53.64,41.85 53.67,41.85 C14.1 52,40.91 U$10.1 | 54.3,45.72 57.63,45.72 v57.66,45.7 | v59.13,45.72 61.2,45.72 62.52,47.04 64.9,47.04 66.4,45.54 66.4,44.6 | U$3.3 65.61,43.81 66.4,44.6 | 66.4,44.6 66.4,42.71 67.24,41.86 68.25,41.86 U$2.18 74.93,36.83 77.47,34.29 77.47,24.23 77.54,24.16 | 77.54,24.16 82.65,19.05 R5.2 86.68,14.92 ICP.2 | 77.54,24.16 v77.54,23.06 | v75.67,21.89 ATMEGA328P.18
  Top 0.61: L1.P$1 41.11,76.73 | 41.11,76.73 C13.1 | 41.11,76.73 41.11,75.22 39.67,73.79 U$11.5
  Top 0.813: U$9.3 C5.1 51.3,75.93 50.49,76.73 L1.P$1
  Bottom 0.508: v57.66,45.7 59.1,45.7 v59.13,45.72 | v77.54,23.06 76.83,23.06 v75.67,21.89
+12V
  Top 0.508: U$8.1 59.28,61.95 58.08,60.74 49.58,60.74 C2.1 37.02,51.8 U$5.3
  Top 0.813: L5.P$2 66.58,61.96 C11.1 U$8.1 | C16.+ 69.04,75.93 C10.1 U$9.1
  Top 1.27: L5.P$2 69.39,69.58 C16.+ | C11.1
ASDO  (via drill 0.35)
  Top 0.203: U$6.6 19.71,40.56 18.75,40.56 18.57,40.74 13.17,40.74 12.63,41.27 U$7.2 9.98,41.27 v10.03,41.32
  Bottom 0.203: AS.9 16.51,47.8 v10.03,41.32
BLUE_0
  Top 0.203: DISPLAY.P$21 15.49,11.42 22.71,18.64 28.68,18.64 30.23,20.19 U$6.54
BLUE_1
  Top 0.203: U$6.55 30.73,20.19 28.83,18.29 22.86,18.29 15.99,11.42 DISPLAY.P$22
BLUE_2
  Top 0.203: DISPLAY.P$23 16.49,11.4 16.9,11.81 23.02,17.93 31.49,17.93 32.23,18.67 U$6.58
BLUE_3
  Top 0.203: U$6.59 32.73,18.67 31.64,17.58 23.17,17.58 17.05,11.46 17.04,11.46 16.99,11.4 DISPLAY.P$24
BLUE_4
  Top 0.203: U$6.60 33.23,18.67 31.79,17.22 23.33,17.22 17.54,11.43 17.53,11.43 17.53,10.2 DISPLAY.P$25
BLUE_5
  Top 0.203: U$6.65 35.73,20.66 31.93,16.87 23.48,16.87 17.99,11.38 DISPLAY.P$26
BLUE_6
  Top 0.203: U$6.66 36.23,20.66 32.08,16.51 23.62,16.51 18.49,11.38 DISPLAY.P$27
BLUE_7
  Top 0.203: DISPLAY.P$28 18.99,11.35 23.8,16.15 32.23,16.15 36.73,20.66 U$6.67
CANH
  Top 0.406: U$3.7 72.25,45.09 D1.1 | D1.1 R1.1 82.79,45.4 TE_AMPSEAL_8.3 | D1.1 72.56,50.65 R9.2
CANL
  Top 0.406: TE_AMPSEAL_8.5 79.07,43.17 R1.2 D1.2 69.96,43.5 69.65,43.81 68.66,43.81 | 68.66,43.81 U$3.6 | 68.66,43.81 68.02,44.45 67.26,44.45 67.06,44.66 67.06,45.51 67.26,45.72 69.54,45.72 69.75,45.93 69.75,51.65 R8.2
CONF_DONE  (via drill 0.35)
  Top 0.203: R15.1 AS.3 9.99,66.04 11.01,67.06 11.85,67.06 12.45,66.46 12.45,66.13 13.55,65.02 22.58,65.02 34.7,52.91 34.7,48.57 36.02,47.25 38.02,47.25 39.47,45.79 39.48,45.79 39.82,45.45 39.82,43.4 38.25,41.82 38.25,37.83 v39.22,36.85 | U$6.92 40.06,35.04 v39.93,34.91
  Bottom 0.203: v39.93,34.91 39.22,35.62 v39.22,36.85
DATA0  (via drill 0.35)
  Top 0.203: U$6.13 17.57,37.04 15.88,38.73 v15.11,38.73 U$7.5 | AS.7 13.37,66.04 12,67.41 8.82,67.41 7.87,66.46 7.87,62.02 5.79,59.94 5.79,42.33 6.57,41.56 6.57,38.32 | 6.55,38.33 6.57,38.32 | 6.57,38.32 7.19,37.69 v12.85,37.69
  Bottom 0.203: v12.85,37.69 13.89,38.73 v15.11,38.73
DCLK  (via drill 0.35)
  Top 0.203: U$6.12 17.86,37.54 15.39,40.01 U$7.6 v12.72,40.01 | v5.71,40.06 5.71,41.91 5.44,42.18 5.44,60.09 6.35,61 AS.1
  Bottom 0.203: v5.71,40.06 12.68,40.06 v12.72,40.01
DISP_CLK
  Top 0.203: U$6.68 37.23,20.65 32.38,15.8 24.69,15.8 20.14,11.25 20.14,11.23 20.04,11.12 20.04,10.21 DISPLAY.P$30
DISP_DEN
  Top 0.203: U$6.72 39.23,20.64 32.97,14.38 25.35,14.38 21.99,11.02 DISPLAY.P$34
DISP_EN
  Top 0.203: U$6.69 37.73,20.65 32.52,15.44 24.84,15.44 20.5,11.1 DISPLAY.P$31
DISP_HSYNC
  Top 0.203: U$6.70 38.13,23.44 38.13,20.55 32.67,15.09 25,15.09 21.01,11.1 21.01,10.18 DISPLAY.P$32
DISP_LEDA  (via drill 0.35)
  Top 0.203: C17.1 38.83,71.39 31.32,71.39 30.48,72.22 DISP_A_T.TP
  Top 0.305: v3.78,16.3 5.37,14.72 5.46,14.72 5.99,14.19 DISPLAY.P$2
  Top 0.508: U$13.C v40.64,64.77
  Top 0.61: C17.1 41.06,69.16 U$14.1 42.45,68.26 U$13.C
  Bottom 0.508: v40.64,64.77 35.34,70.07 30.77,70.07 20.78,80.06 5.44,80.06 3.71,78.33 3.71,16.33 3.68,16.3 v3.78,16.3
DISP_LEDK  (via drill 0.35)
  Top 0.305: v3.81,15.24 4.79,14.27 5.27,14.27 5.45,14.09 5.45,10.21 DISPLAY.P$1
  Top 0.508: R19.1 33.97,73.91 v33.68,73.62
  Top 0.61: R19.1 37.03,76.2 U$11.3
  Bottom 0.508: v3.81,15.24 3.02,16.03 3.02,78.57 5.17,80.72 21.05,80.72 28.15,73.62 v33.68,73.62
DISP_PWM  (via drill 0.35)
  Top 0.203: R3.2 v35.31,73.73 35.36,73.78 U$11.4 | ATMEGA328P.13 v76.71,16.92 | v34.01,60.17 v34.01,70.81
  Bottom 0.203: v76.71,16.92 34.01,59.61 v34.01,60.17 | v34.01,70.81 34.01,72.43 v35.31,73.73
DISP_VSYNC
  Top 0.203: U$6.71 38.73,20.64 32.82,14.73 25.15,14.73 21.49,11.07 DISPLAY.P$33
DISP_XL
  Top 0.203: U$6.75 40.25,26.54 39.99,26.28 39.99,20.39 33.26,13.66 30.86,13.66 27.59,10.4 25.73,10.4 25.39,10.06 25.39,9.43 25.21,9.25 24.54,9.25 24.46,9.32 24.46,10.13 DISPLAY.P$39
DISP_XR  (via drill 0.35)
  Top 0.203: DISPLAY.P$37 23.59,10.06 23.59,9.19 24.24,8.53 25.5,8.53 26.11,9.13 26.11,9.3 26.49,9.69 27.89,9.69 31.15,12.95 33.56,12.95 40.93,20.32 v40.93,21.39 | v40.57,22.67 40.57,24.88 U$6.73
  Bottom 0.203: v40.93,21.39 40.93,22.32 v40.57,22.67
DISP_YD
  Top 0.203: U$6.74 42.44,26.04 43,25.48 43,24.28 40.34,21.62 40.34,20.24 33.41,13.31 31,13.31 27.74,10.04 25.88,10.04 25.75,9.91 25.75,9.28 25.36,8.89 24.39,8.89 24.11,9.18 24.11,9.2 23.98,9.32 23.99,9.33 DISPLAY.P$38
DISP_YU
  Top 0.203: DISPLAY.P$40 25.59,10.76 27.45,10.76 30.71,14.02 33.12,14.02 39.63,20.54 39.63,26.43 40.23,27.03 41.22,27.03 U$6.76
FPGA_D0_3_3
  Top 0.203: U$6.87 44.24,32.54 45.67,31.11 U4.2
FPGA_D1_3_3
  Top 0.203: U4.4 45.36,29.94 45.36,30.92 44.24,32.04 U$6.86
FPGA_D2_3_3
  Top 0.203: U4.6 45.01,27.76 45.01,30.73 44.2,31.54 U$6.85
FPGA_D3_3_3
  Top 0.203: U4.10 50.47,26.62 50.47,31.97 43.4,39.04 U$6.100
FPGA_DATA0  (via drill 0.35)
  Top 0.203: U4.3 47.6,29.84 v47.62,29.82 | v70.48,22.12 70.98,21.61 71.22,21.61 71.65,21.19 ATMEGA328P.23
  Bottom 0.203: v70.48,22.12 70.02,21.65 58.9,21.65 54.28,26.28 54.28,26.42 53.73,26.97 50.47,26.97 v47.62,29.82
FPGA_DATA1  (via drill 0.35)
  Top 0.203: U4.5 47.65,27.3 v47.68,27.28 | v70.48,21.26 70.87,20.88 ATMEGA328P.24
  Bottom 0.203: v47.68,27.28 48.34,26.62 53.58,26.62 53.92,26.28 53.92,25.96 58.58,21.3 70.45,21.3 v70.48,21.26
FPGA_DATA2  (via drill 0.35)
  Top 0.203: ATMEGA328P.25 68.31,19.3 v68.15,19.14 | v48.06,24.77 U4.7
  Bottom 0.203: v68.15,19.14 68.15,18.98 68.6,18.53 68.6,18.03 67.33,16.76 66.56,16.76 66.33,16.98 61.38,16.98 55.64,22.73 50.09,22.73 v48.06,24.77
FPGA_DATA3  (via drill 0.35)
  Top 0.203: ATMEGA328P.26 68.25,18.52 v68.02,18.29 | v53.29,23.52 53.26,23.5 U4.9
  Bottom 0.203: v68.02,18.29 67.53,17.79 67.53,17.45 67.19,17.11 66.71,17.11 66.48,17.34 61.53,17.34 55.35,23.52 v53.29,23.52
FPGA_R0_3_3
  Top 0.203: U5.10 51.61,12.78 46.02,12.78 43.59,15.22 43.59,26.72 42.77,27.54 U$6.77
FPGA_R1_3_3
  Top 0.203: U5.6 43.94,16.12 43.94,28.6 43.5,29.04 U$6.80
FPGA_R2_3_3
  Top 0.203: U5.4 44.3,18.31 44.3,30.2 43.96,30.54 U$6.83
FPGA_R3_3_3
  Top 0.203: U5.2 46.73,18.43 44.65,20.5 44.65,30.59 44.2,31.04 U$6.84
FPGA_REG0  (via drill 0.35)
  Top 0.203: ATMEGA328P.2 71.65,13.28 v71.86,13.49 | v53.57,11.02 53.31,10.77 52.35,10.77 U5.9
  Bottom 0.203: v71.86,13.49 71.86,14.2 71.6,14.45 54.53,14.45 53.57,13.49 v53.57,11.02
FPGA_REG1  (via drill 0.35)
  Top 0.203: ATMEGA328P.9 76.62,13.72 v76.53,13.8 | v47.8,12.09 47.78,12.06 U5.7
  Bottom 0.203: v76.53,13.8 75.53,14.81 49.25,14.81 48.13,13.69 48.13,12.42 v47.8,12.09
FPGA_REG2  (via drill 0.35)
  Top 0.203: ATMEGA328P.10 76.74,14.5 v76.58,14.66 | v47.85,14.61 U5.5
  Bottom 0.203: v76.58,14.66 76.08,15.16 48.41,15.16 v47.85,14.61
FPGA_REG3  (via drill 0.35)
  Top 0.203: ATMEGA328P.11 76.78,15.32 v76.58,15.52 | v47.78,17.14 U5.3
  Bottom 0.203: v76.58,15.52 49.4,15.52 v47.78,17.14
FPGA_REG_SEL  (via drill 0.35)
  Top 0.203: ATMEGA328P.27 v66.95,17.7 | v53.34,26.04 U4.11
  Bottom 0.203: v66.95,17.7 61.68,17.7 v53.34,26.04
FPGA_RSEL_3_3
  Top 0.203: U4.12 50.83,28.81 50.83,32.12 44.2,38.75 44.2,40.59 43.25,41.54 U$6.105
FPGA_W_3_3
  Top 0.203: U4.15 44.55,38.89 44.55,40.74 43.25,42.04 U$6.106
FPGA_WRITE  (via drill 0.35)
  Top 0.203: U4.14 52.33,29.83 53.92,28.24 53.92,24.39 54,24.31 54,14.64 v54.77,13.87 | v70.18,12.98 70.28,12.98 ATMEGA328P.1
  Bottom 0.203: v54.77,13.87 69.29,13.87 v70.18,12.98
GND  (via drill 0.35)
  Top 0.305: U$6.63 34.73,24.25 34.72,24.26 | U$6.64 35.23,24.28 | 35.23,24.28 | U$6.96 42.02,37.04 42.04,37.06 | U$6.95 42.12,36.54 42.16,36.5
  other vias: 19.05,24.13 23.42,22.45 27.03,22.23 31.47,22.33 42.55,28.3 42.55,29.77 47.04,21.69 76.5,44.48 65.43,45.09 27.97,7.65 46.74,9.65 7.26,38.73 32.23,46.28 36.78,50.14 43,43.54 43.03,40.28 43.1,37.85 21.18,33.91 22.86,29.24 18.01,41.88 13.54,63.98 5.61,38.79 66.88,71.6 59.26,63.98 65.61,63.98 40.08,76.1 50.57,41.94 56.34,42.85
  pour Top: 0,83.82 96.52,83.82 96.52,0 0,0
  pour Bottom: 0,0 96.52,0 96.52,83.82 0,83.82
GREEN_0
  Top 0.203: U$6.43 24.73,22.31 23.91,21.49 21.49,21.49 11.68,11.68 11.68,11.66 11.49,11.46 DISPLAY.P$13
GREEN_1
  Top 0.203: U$6.44 25.23,22.31 24.05,21.13 21.65,21.13 12.05,11.53 12.04,11.53 12.04,10.21 DISPLAY.P$14
GREEN_2
  Top 0.203: DISPLAY.P$15 12.49,11.47 12.88,11.86 12.89,11.86 21.81,20.78 25.43,20.78 26.19,21.54 26.19,23.5 U$6.46
GREEN_3
  Top 0.203: U$6.49 27.73,21.81 26.34,20.42 21.96,20.42 13.04,11.51 13.03,11.51 12.99,11.47 DISPLAY.P$16
GREEN_4
  Top 0.203: DISPLAY.P$17 13.49,11.45 13.9,11.86 13.91,11.86 22.11,20.07 27.92,20.07 28.21,20.36 28.21,23.52 U$6.50
GREEN_5
  Top 0.203: U$6.51 28.73,20.37 28.07,19.71 22.26,19.71 14.06,11.51 14.05,11.51 13.99,11.45 DISPLAY.P$18
GREEN_6
  Top 0.203: DISPLAY.P$19 14.49,11.44 22.41,19.36 28.39,19.36 29.23,20.2 U$6.52
GREEN_7
  Top 0.203: U$6.53 29.73,20.2 28.53,19 22.55,19 14.99,11.43 DISPLAY.P$20
LED1  (via drill 0.35)
  Top 0.305: U$6.144 v21.73,46.14 v21.72,46.15 | v37.03,3.79 38.3,3.79 FPGA.C
  Bottom 0.305: v21.72,46.15 18.91,43.34 18.91,39.32 18.54,38.95 17.69,38.95 16.18,37.44 16.18,23.32 35.71,3.79 v37.03,3.79
LED2
  Top 0.406: ATMEGA328P.14 79.22,17.7 79.22,15.72 84.63,10.31 89.1,10.31 90.44,11.65 MICRO.C
MISO
  Top 0.203: ICP.1 84.1,13.97 78.77,19.3 ATMEGA328P.16 76.96,20.12 76.96,28.44 74.7,30.7 74.7,32.79 74.47,33.02 U$2.15
MOSI  (via drill 0.35)
  Top 0.203: ICP.4 86.11,12.95 84.61,12.95 79.05,18.52 ATMEGA328P.15 76.81,18.52 v76.58,18.75 | v71.93,31.75 U$2.14
  Bottom 0.203: v76.58,18.75 76.3,19.03 76.21,19.03 71.93,23.31 v71.93,31.75
N$1
  Top 1.27: FUSE.P$1 FUSE.P$4 80.85,70.23 L5.P$1
N$2
  Top 0.305: FPGA.A R4.1
N$3
  Top 0.406: MICRO.A 91.44,16.19 R5.1
N$4
  Top 0.406: R6.1 91.98,69.53 3.3V.A
N$5
  Top 0.406: U$3.8 68.4,49.67 R10.2
N$6
  Top 0.406: R8.1 C8.1
N$7
  Top 0.406: R9.1 C9.1
N$8
  Top 0.61: U$14.2 44.45,70.26 L1.P$2 40.09,73.13 39.69,72.72 38.56,72.72 38.29,73 38.29,74.56 39.05,75.33 U$11.1
N$10  (via drill 0.35)
  Top 0.203: U$6.9 18.81,39.04 v18.27,39.58 | v16.54,41.32 15.49,42.36 15.49,45.59 14.1,46.99 R13.1
  Bottom 0.203: v18.27,39.58 v16.54,41.32
N$12
  Top 0.406: R20.1 93.88,72.71 5V.A
N$19
  Top 0.406: R17.2 U$10.4 49.65,45.52 R18.1
NCE
  Top 0.203: R16.1 11.43,69 AS.6 10.33,68.58 9.31,69.6 8.47,69.6 7.52,68.64 7.52,67.51 6.38,67.51 5.33,66.46 5.33,60.49 5.03,60.19 5.03,35.61 7.62,33.02 19.71,33.02 U$6.21
NCONFIG
  Top 0.203: AS.5 R14.1 11.43,63.04 12.43,62.03 12.43,60.52 7.59,55.69 7.59,41.03 7.88,40.74 10.63,40.74 14.73,36.64 19.63,36.64 U$6.14
NCSO  (via drill 0.35)
  Top 0.203: v12.88,41.85 12.19,42.55 U$7.1 8.79,43.18 v8.71,43.26 | v16.06,40.16 18.51,40.16 19.13,39.54 U$6.8 | v6.38,42.57 6.38,59.7 v7.31,60.64
  Bottom 0.203: v12.88,41.85 14.57,40.16 v16.06,40.16 | AS.8 12.45,67.06 8.47,67.06 8.04,66.62 8.03,66.62 7.37,65.96 7.37,65.62 7.31,65.56 v7.31,60.64 | v8.71,43.26 8.03,42.57 v6.38,42.57
PWR_IN_12
  Top 1.27: FUSE.P$3 FUSE.P$2 91.02,58.12 TE_AMPSEAL_8.8
RED_0
  Top 0.203: U$6.28 19.1,29.54 15.72,26.16 15.72,19.79 7.49,11.56 DISPLAY.P$5
RED_1
  Top 0.203: DISPLAY.P$6 7.99,11.55 16.08,19.64 16.08,24.96 19.01,27.9 19.03,27.9 19.13,27.99 19.68,27.99 U$6.31
RED_2
  Top 0.203: DISPLAY.P$7 8.59,10.26 8.59,11.64 9.59,12.65 9.6,12.65 16.43,19.48 16.43,24.82 19.16,27.54 U$6.32
RED_3
  Top 0.203: DISPLAY.P$8 8.99,11.54 9.74,12.29 9.75,12.29 16.79,19.33 16.79,24.61 19.18,27 19.69,27 U$6.33
RED_4
  Top 0.203: DISPLAY.P$9 9.53,10.2 9.53,11.58 9.89,11.94 9.9,11.94 17.14,19.19 17.14,24.46 19.22,26.54 U$6.34
RED_5
  Top 0.203: U$6.38 22.23,22.69 22.1,22.55 21.02,22.55 10.04,11.58 10.03,11.58 10.03,10.2 DISPLAY.P$10
RED_6
  Top 0.203: DISPLAY.P$11 10.49,11.53 21.16,22.2 22.33,22.2 22.73,22.61 U$6.39
RED_7
  Top 0.203: U$6.42 24.23,22.32 23.76,21.84 21.31,21.84 10.99,11.52 DISPLAY.P$12
RESET  (via drill 0.35)
  Top 0.203: v70.46,16.1 ATMEGA328P.29 69.24,16.41 66.91,16.41 66.01,17.31 66.01,18.33 67.76,20.08 68.34,20.08 69.19,20.92 69.19,27.32 71,29.13 71,34.27 72.29,35.56 U$2.17 | ICP.5 85.09,5.4 R7.1
  Bottom 0.203: v70.46,16.1 77.88,16.1 ICP.5
RXCAN
  Top 0.203: U$3.4 65.33,40.89 65.33,36.09 64.8,35.56 U$2.2
SCK  (via drill 0.35)
  Top 0.203: v76.45,19.61 ATMEGA328P.17 76.45,28.45 74.4,30.5 74.37,30.48 U$2.13
  Bottom 0.203: ICP.3 76.91,19.61 v76.45,19.61
TCK  (via drill 0.35)
  Top 0.203: 5.13,34.29 v5.13,34.19 5.13,34.51 4.22,35.41 4.22,72.13 6.35,74.26 JTAG.1 | v7.24,34.22 15.63,34.22 16.95,35.54 U$6.16 | v11.33,71.75 R2.2
  Bottom 0.203: v5.13,34.19 5.16,34.22 v7.24,34.22 | v11.33,71.75 9.17,73.91 8.47,73.91 7.45,74.93 JTAG.1
TDI  (via drill 0.35)
  Top 0.203: JTAG.9 17.73,76.15 20.46,76.15 21.37,75.25 R11.2 21.61,74.79 v21.61,65.61 | U$6.15 19.83,36.14 20.34,36.14 21.46,37.26 21.46,44.3 21.14,44.62 21.14,46.39 21.59,46.85 v21.59,64.44
  Bottom 0.203: v21.59,64.44 21.59,65.58 v21.61,65.61
TDO  (via drill 0.35)
  Top 0.203: JTAG.3 6.82,72.86 5.45,72.86 4.6,72 4.6,35.59 4.58,35.56 6.18,33.96 v6.18,33.64 | v7.86,33.6 19.67,33.6 U$6.20
  Bottom 0.203: v6.18,33.64 7.83,33.64 v7.86,33.6
TMS  (via drill 0.35)
  Top 0.203: R12.1 18.27,73.91 13.55,73.91 12.53,74.93 JTAG.5 10.33,74.93 9.31,75.95 5.93,75.95 3.86,73.88 3.86,34.87 4.55,34.19 4.55,33.95 5.83,32.66 10.87,32.66 12.38,31.16 12.38,29.57 12.53,29.42 15.31,29.42 v17.86,31.96 | v18.36,34.18 18.73,34.54 U$6.18
  Bottom 0.203: v17.86,31.96 17.86,33.67 v18.36,34.18
TXCAN
  Top 0.203: U$2.1 62.28,38.43 62.28,45.9 62.71,46.33 63.65,46.33 U$3.1
V+
  Top 0.203: 43.18,42.49 44.45,43.77 2.5T.TP
  Top 0.305: R17.1 44.91,40.96 43.37,42.49 43.18,42.49 41.27,42.49 U$6.107 41.19,42.49 40.6,42.49 38.84,40.73 38.84,38.56 39.85,37.54 | 39.85,37.54 U$6.97 | U$6.94 40.19,36.04 39.85,36.37 | 39.85,36.37 39.85,37.54 | 39.85,36.37 39.7,36.22 37.25,36.22 27.08,26.04 U$6.35
  Top 0.406: R17.1 U$10.5 49.65,38.25 C15.1
VCC  (via drill 0.35)
  Top 0.203: v26.74,47.06 1.2T.TP
  Top 0.305: v35.74,43.69 U$6.116 | v39.24,43.64 39.24,45.03 U$6.109 | v39.9,28.02 41.21,28.02 U$6.78 | U$6.61 33.73,24.49 v33.53,24.69 | v25.76,24.66 25.76,23.57 U$6.45 | v21.74,24.51 21.74,23.55 U$6.37 | v21.06,29.03 U$6.29 | v20.88,41.05 U$6.5 | v26.75,43.79 26.75,45.02 U$6.134 | U$5.2 37.77,48.54 v37.72,48.49 | v40.01,39.04 40.11,39.14 40.11,40.03 40.12,40.04 U$6.102
  Bottom 0.203: v26.75,43.79 v26.75,47.06 v26.74,47.06
  Bottom 0.305: C1.1 34.42,43.05 | 34.42,43.05 35.07,43.69 | 35.07,43.69 v35.74,43.69 39.19,43.69 v39.24,43.64 | C21.1 36.56,31.36 v39.9,28.02 | C22.1 32.73,24.69 v33.53,24.69 | C22.1 25.76,24.76 v25.76,24.66 22.86,24.66 | 22.86,24.66 21.89,24.66 v21.74,24.51 | 21.06,29.21 21.06,32.22 C23.1 24.37,35.59 | 21.06,29.21 v21.06,29.03 | 24.37,35.59 20.88,39.08 v20.88,41.05 | C1.1 28.33,43.79 v26.75,43.79 | v37.72,48.49 35.07,45.84 35.07,43.69 | C1.1 30.32,38.94 30.32,37.59 29.39,36.66 25.62,36.66 24.55,35.59 24.37,35.59 | C22.1 30.64,29.64 30.64,30.99 30.82,31.16 34.59,31.16 36.44,33.02 C21.1 | 21.06,29.21 22.86,27.41 22.86,24.66 | C21.1 36.56,33.68 38.15,35.27 38.15,37.18 39.22,38.25 | 39.22,38.25 v40.01,39.04 | 34.42,43.05 39.22,38.25
XTAL1
  Top 0.203: ATMEGA328P.7 75.67,7.89 U$4.3 68.98,4.95 C3.2
XTAL2
  Top 0.203: ATMEGA328P.8 76.45,8.43 U$4.1 80.88,7.75 C4.1
~CS_CAN
  Top 0.203: ATMEGA328P.28 66.9,16.92 66.36,17.45 66.36,18.18 67.91,19.73 68.49,19.73 69.55,20.78 69.55,27.17 71.35,28.98 71.35,33.63 72.01,34.29 U$2.16
~INT_CAN  (via drill 0.35)
  Top 0.203: ATMEGA328P.32 69.83,13.99 70.39,13.99 70.76,14.37 70.76,14.93 71.04,15.21 71.04,16.34 70.76,16.62 v70.76,16.96 | v69.9,20.09 69.9,27.03 72.08,29.21 U$2.12
  Bottom 0.203: v70.76,16.96 69.9,17.82 v69.9,20.09

### Text on the board
tNames: IFE 2018 / DISPLAY